# EasyEDA Pro project adapter_rfm95w_nrf242.eprj, board adapter_rfm95w_nrf24
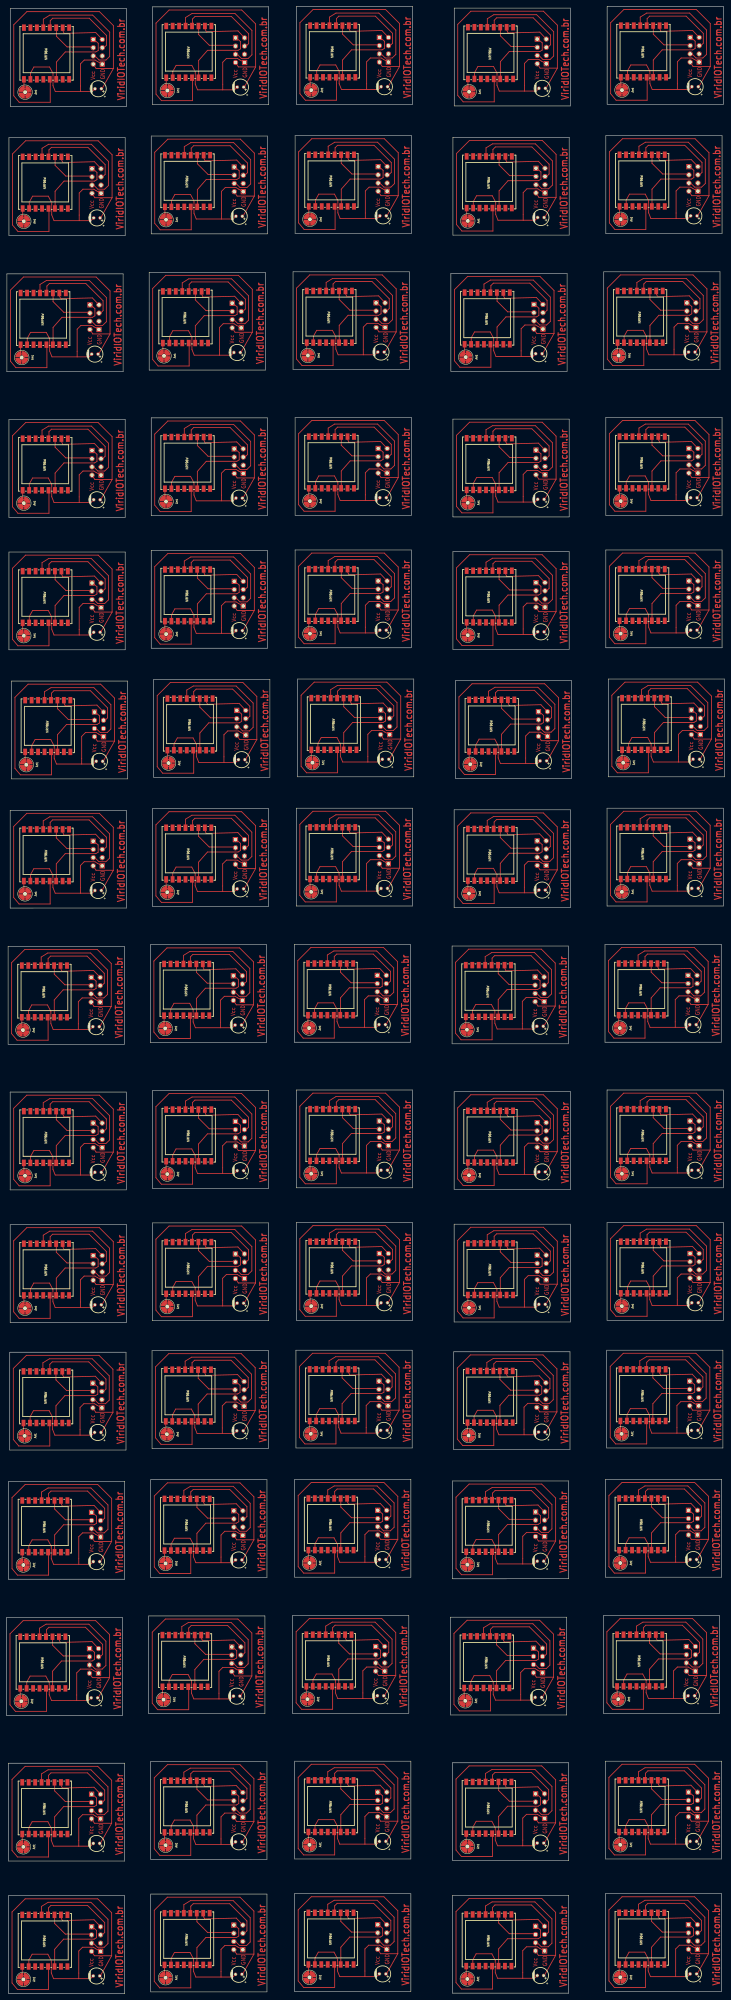
[diagram p1: board, top side]
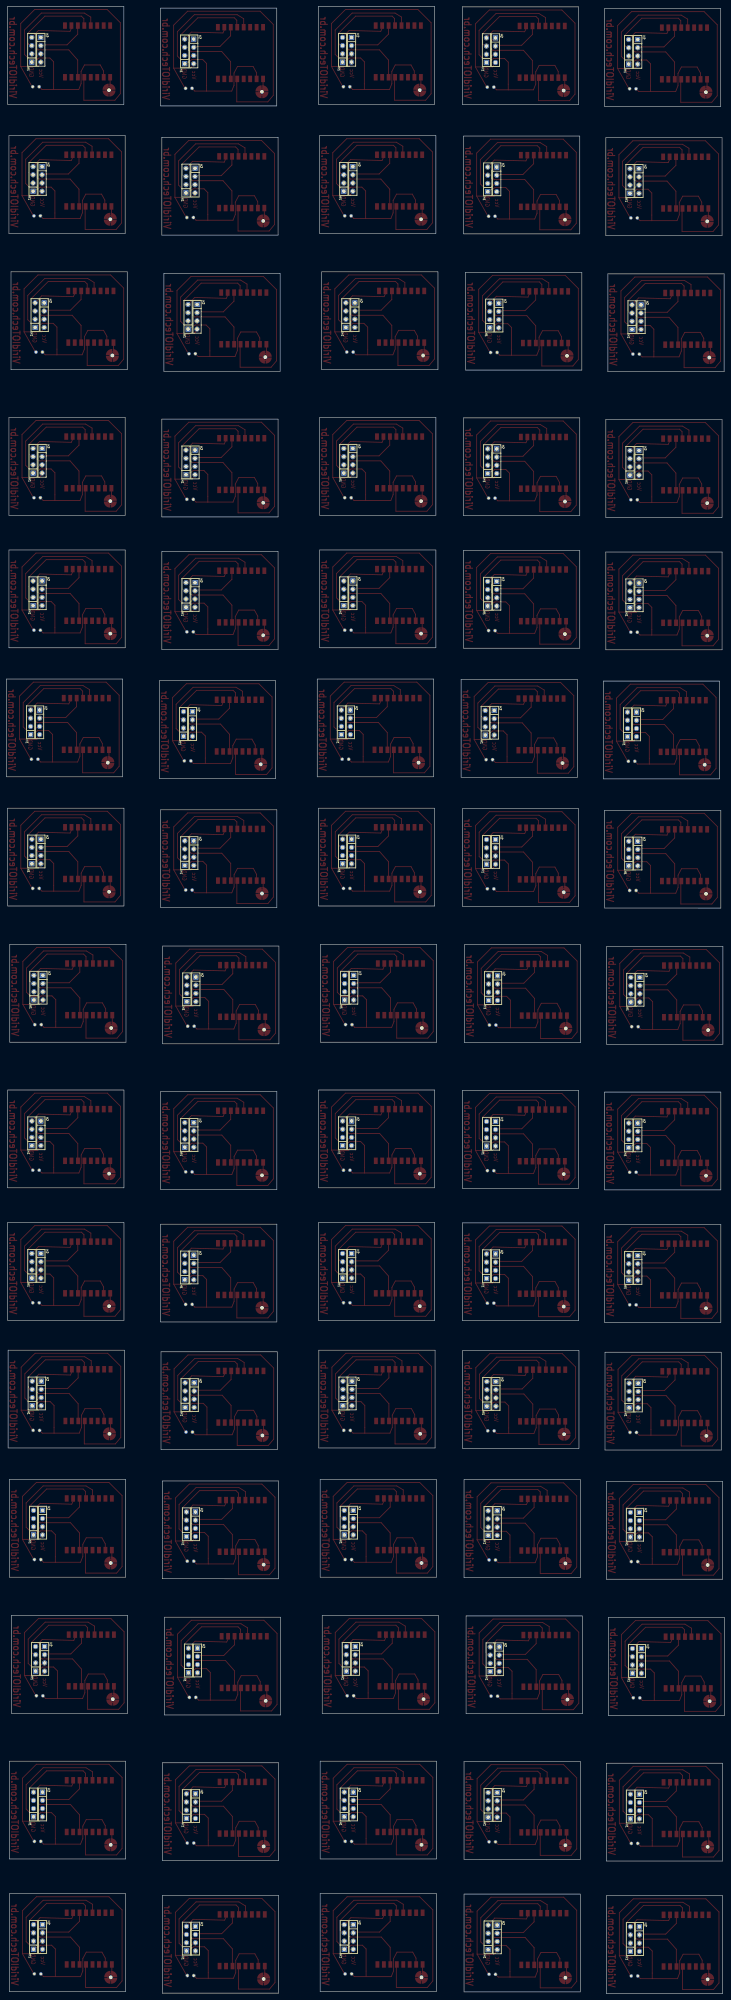
[diagram p2: board, bottom side, seen from below]

Outline 222.45 x 615.16 mm; copper layers: Top Layer, Bottom Layer. Coordinates in mm from the lower left corner of the outline.
Stack: Top Layer 0.035mm / Dielectric1 1.51mm FR4 er 4.5 / Bottom Layer 0.035mm

## Design rules (mm)
spacing safeClearance (default): track to track 0.152, other pairs 0.152 to 0.3
track width trackWidth (default): min 0.127, default 0.254, max 2.54
differential pair differentialPair (default): width min 0.127, default 0.254, max 2.54; gap min 0.152, default 0.152
via viaSize (default): diameter min 0.5, default 0.61, max 10; hole min 0.3, default 0.305, max 6

## Placement (name value [footprint] x y rotation side)
+  -  [CAP-TH_BD5.0-P2.00-D0.5-FD]  28.42 589.68 180 top
+#2  -  [CAP-TH_BD5.0-P2.00-D0.5-FD]  72.49 590.19 180 top
+#3  -  [CAP-TH_BD5.0-P2.00-D0.5-FD]  117.07 590.32 180 top
+#4  -  [CAP-TH_BD5.0-P2.00-D0.5-FD]  165.96 589.81 180 top
+#5  -  [CAP-TH_BD5.0-P2.00-D0.5-FD]  213.34 590.32 180 top
+#6  -  [CAP-TH_BD5.0-P2.00-D0.5-FD]  28.02 549.7 180 top
+#7  -  [CAP-TH_BD5.0-P2.00-D0.5-FD]  72.09 550.2 180 top
+#8  -  [CAP-TH_BD5.0-P2.00-D0.5-FD]  116.67 550.33 180 top
+#9  -  [CAP-TH_BD5.0-P2.00-D0.5-FD]  165.57 549.82 180 top
+#10  -  [CAP-TH_BD5.0-P2.00-D0.5-FD]  212.94 550.33 180 top
+#11  -  [CAP-TH_BD5.0-P2.00-D0.5-FD]  27.39 507.53 180 top
+#12  -  [CAP-TH_BD5.0-P2.00-D0.5-FD]  71.46 508.04 180 top
+#13  -  [CAP-TH_BD5.0-P2.00-D0.5-FD]  116.04 508.17 180 top
+#14  -  [CAP-TH_BD5.0-P2.00-D0.5-FD]  164.93 507.66 180 top
+#15  -  [CAP-TH_BD5.0-P2.00-D0.5-FD]  212.3 508.17 180 top
+#16  -  [CAP-TH_BD5.0-P2.00-D0.5-FD]  28.02 462.45 180 top
+#17  -  [CAP-TH_BD5.0-P2.00-D0.5-FD]  72.09 462.95 180 top
+#18  -  [CAP-TH_BD5.0-P2.00-D0.5-FD]  116.67 463.08 180 top
+#19  -  [CAP-TH_BD5.0-P2.00-D0.5-FD]  165.57 462.57 180 top
+#20  -  [CAP-TH_BD5.0-P2.00-D0.5-FD]  212.94 463.08 180 top
+#21  -  [CAP-TH_BD5.0-P2.00-D0.5-FD]  28.02 421.43 180 top
+#22  -  [CAP-TH_BD5.0-P2.00-D0.5-FD]  72.09 421.93 180 top
+#23  -  [CAP-TH_BD5.0-P2.00-D0.5-FD]  116.67 422.06 180 top
+#24  -  [CAP-TH_BD5.0-P2.00-D0.5-FD]  165.57 421.55 180 top
+#25  -  [CAP-TH_BD5.0-P2.00-D0.5-FD]  212.94 422.06 180 top
+#26  -  [CAP-TH_BD5.0-P2.00-D0.5-FD]  27.76 299.32 180 top
+#27  -  [CAP-TH_BD5.0-P2.00-D0.5-FD]  28.4 254.24 180 top
+#28  -  [CAP-TH_BD5.0-P2.00-D0.5-FD]  28.4 341.49 180 top
+#29  -  [CAP-TH_BD5.0-P2.00-D0.5-FD]  28.4 213.22 180 top
+#30  -  [CAP-TH_BD5.0-P2.00-D0.5-FD]  28.8 381.48 180 top
+#31  -  [CAP-TH_BD5.0-P2.00-D0.5-FD]  71.83 299.83 180 top
+#32  -  [CAP-TH_BD5.0-P2.00-D0.5-FD]  72.47 342 180 top
+#33  -  [CAP-TH_BD5.0-P2.00-D0.5-FD]  72.47 254.75 180 top
+#34  -  [CAP-TH_BD5.0-P2.00-D0.5-FD]  72.47 213.73 180 top
+#35  -  [CAP-TH_BD5.0-P2.00-D0.5-FD]  72.86 381.98 180 top
+#36  -  [CAP-TH_BD5.0-P2.00-D0.5-FD]  116.41 299.96 180 top
+#37  -  [CAP-TH_BD5.0-P2.00-D0.5-FD]  117.04 213.85 180 top
+#38  -  [CAP-TH_BD5.0-P2.00-D0.5-FD]  117.04 342.12 180 top
+#39  -  [CAP-TH_BD5.0-P2.00-D0.5-FD]  117.04 254.87 180 top
+#40  -  [CAP-TH_BD5.0-P2.00-D0.5-FD]  117.44 382.11 180 top
+#41  -  [CAP-TH_BD5.0-P2.00-D0.5-FD]  165.3 299.45 180 top
+#42  -  [CAP-TH_BD5.0-P2.00-D0.5-FD]  165.94 213.34 180 top
+#43  -  [CAP-TH_BD5.0-P2.00-D0.5-FD]  165.94 254.37 180 top
+#44  -  [CAP-TH_BD5.0-P2.00-D0.5-FD]  165.94 341.62 180 top
+#45  -  [CAP-TH_BD5.0-P2.00-D0.5-FD]  166.34 381.6 180 top
+#46  -  [CAP-TH_BD5.0-P2.00-D0.5-FD]  212.67 299.96 180 top
+#47  -  [CAP-TH_BD5.0-P2.00-D0.5-FD]  213.31 213.85 180 top
+#48  -  [CAP-TH_BD5.0-P2.00-D0.5-FD]  213.31 342.12 180 top
+#49  -  [CAP-TH_BD5.0-P2.00-D0.5-FD]  213.31 254.87 180 top
+#50  -  [CAP-TH_BD5.0-P2.00-D0.5-FD]  213.71 382.11 180 top
+#51  -  [CAP-TH_BD5.0-P2.00-D0.5-FD]  27.25 91.55 180 top
+#52  -  [CAP-TH_BD5.0-P2.00-D0.5-FD]  27.89 46.47 180 top
+#53  -  [CAP-TH_BD5.0-P2.00-D0.5-FD]  27.89 133.72 180 top
+#54  -  [CAP-TH_BD5.0-P2.00-D0.5-FD]  27.89 5.45 180 top
+#55  -  [CAP-TH_BD5.0-P2.00-D0.5-FD]  28.29 173.7 180 top
+#56  -  [CAP-TH_BD5.0-P2.00-D0.5-FD]  71.32 92.06 180 top
+#57  -  [CAP-TH_BD5.0-P2.00-D0.5-FD]  71.96 134.22 180 top
+#58  -  [CAP-TH_BD5.0-P2.00-D0.5-FD]  71.96 46.98 180 top
+#59  -  [CAP-TH_BD5.0-P2.00-D0.5-FD]  71.96 5.95 180 top
+#60  -  [CAP-TH_BD5.0-P2.00-D0.5-FD]  72.36 174.21 180 top
+#61  -  [CAP-TH_BD5.0-P2.00-D0.5-FD]  115.9 92.19 180 top
+#62  -  [CAP-TH_BD5.0-P2.00-D0.5-FD]  116.53 6.08 180 top
+#63  -  [CAP-TH_BD5.0-P2.00-D0.5-FD]  116.53 134.35 180 top
+#64  -  [CAP-TH_BD5.0-P2.00-D0.5-FD]  116.53 47.1 180 top
+#65  -  [CAP-TH_BD5.0-P2.00-D0.5-FD]  116.93 174.34 180 top
+#66  -  [CAP-TH_BD5.0-P2.00-D0.5-FD]  164.8 91.68 180 top
+#67  -  [CAP-TH_BD5.0-P2.00-D0.5-FD]  165.43 5.57 180 top
+#68  -  [CAP-TH_BD5.0-P2.00-D0.5-FD]  165.43 46.59 180 top
+#69  -  [CAP-TH_BD5.0-P2.00-D0.5-FD]  165.43 133.84 180 top
+#70  -  [CAP-TH_BD5.0-P2.00-D0.5-FD]  165.83 173.83 180 top
+#71  -  [CAP-TH_BD5.0-P2.00-D0.5-FD]  212.17 92.19 180 top
+#72  -  [CAP-TH_BD5.0-P2.00-D0.5-FD]  212.8 6.08 180 top
+#73  -  [CAP-TH_BD5.0-P2.00-D0.5-FD]  212.8 134.35 180 top
+#74  -  [CAP-TH_BD5.0-P2.00-D0.5-FD]  212.8 47.1 180 top
+#75  -  [CAP-TH_BD5.0-P2.00-D0.5-FD]  213.2 174.34 180 top
Ant  -  [SMD_BD4.0-L4.0-W4.0-D1.0]  5.37 548.64 0 top
Ant#2  -  [SMD_BD4.0-L4.0-W4.0-D1.0]  49.84 589.13 0 top
Ant#3  -  [SMD_BD4.0-L4.0-W4.0-D1.0]  94.42 589.26 0 top
Ant#4  -  [SMD_BD4.0-L4.0-W4.0-D1.0]  143.31 588.75 0 top
Ant#5  -  [SMD_BD4.0-L4.0-W4.0-D1.0]  190.68 589.26 0 top
Ant#6  -  [SMD_BD4.0-L4.0-W4.0-D1.0]  49.44 549.14 0 top
Ant#7  -  [SMD_BD4.0-L4.0-W4.0-D1.0]  94.02 549.27 0 top
Ant#8  -  [SMD_BD4.0-L4.0-W4.0-D1.0]  142.91 548.76 0 top
Ant#9  -  [SMD_BD4.0-L4.0-W4.0-D1.0]  190.28 549.27 0 top
Ant#10  -  [SMD_BD4.0-L4.0-W4.0-D1.0]  4.74 506.47 0 top
Ant#11  -  [SMD_BD4.0-L4.0-W4.0-D1.0]  48.81 506.98 0 top
Ant#12  -  [SMD_BD4.0-L4.0-W4.0-D1.0]  93.38 507.11 0 top
Ant#13  -  [SMD_BD4.0-L4.0-W4.0-D1.0]  142.28 506.6 0 top
Ant#14  -  [SMD_BD4.0-L4.0-W4.0-D1.0]  189.65 507.11 0 top
Ant#15  -  [SMD_BD4.0-L4.0-W4.0-D1.0]  5.37 461.39 0 top
Ant#16  -  [SMD_BD4.0-L4.0-W4.0-D1.0]  49.44 461.89 0 top
Ant#17  -  [SMD_BD4.0-L4.0-W4.0-D1.0]  94.02 462.02 0 top
Ant#18  -  [SMD_BD4.0-L4.0-W4.0-D1.0]  142.91 461.51 0 top
Ant#19  -  [SMD_BD4.0-L4.0-W4.0-D1.0]  190.28 462.02 0 top
Ant#20  -  [SMD_BD4.0-L4.0-W4.0-D1.0]  5.37 420.37 0 top
Ant#21  -  [SMD_BD4.0-L4.0-W4.0-D1.0]  49.44 420.87 0 top
Ant#22  -  [SMD_BD4.0-L4.0-W4.0-D1.0]  94.02 421 0 top
Ant#23  -  [SMD_BD4.0-L4.0-W4.0-D1.0]  142.91 420.49 0 top
Ant#24  -  [SMD_BD4.0-L4.0-W4.0-D1.0]  190.28 421 0 top
Ant#25  -  [SMD_BD4.0-L4.0-W4.0-D1.0]  5.11 298.26 0 top
Ant#26  -  [SMD_BD4.0-L4.0-W4.0-D1.0]  5.74 340.43 0 top
Ant#27  -  [SMD_BD4.0-L4.0-W4.0-D1.0]  5.74 253.18 0 top
Ant#28  -  [SMD_BD4.0-L4.0-W4.0-D1.0]  5.74 212.16 0 top
Ant#29  -  [SMD_BD4.0-L4.0-W4.0-D1.0]  6.14 380.42 0 top
Ant#30  -  [SMD_BD4.0-L4.0-W4.0-D1.0]  49.18 298.77 0 top
Ant#31  -  [SMD_BD4.0-L4.0-W4.0-D1.0]  49.81 340.94 0 top
Ant#32  -  [SMD_BD4.0-L4.0-W4.0-D1.0]  49.81 212.67 0 top
Ant#33  -  [SMD_BD4.0-L4.0-W4.0-D1.0]  49.81 253.69 0 top
Ant#34  -  [SMD_BD4.0-L4.0-W4.0-D1.0]  50.21 380.92 0 top
Ant#35  -  [SMD_BD4.0-L4.0-W4.0-D1.0]  93.75 298.9 0 top
Ant#36  -  [SMD_BD4.0-L4.0-W4.0-D1.0]  94.39 253.81 0 top
Ant#37  -  [SMD_BD4.0-L4.0-W4.0-D1.0]  94.39 341.06 0 top
Ant#38  -  [SMD_BD4.0-L4.0-W4.0-D1.0]  94.39 212.79 0 top
Ant#39  -  [SMD_BD4.0-L4.0-W4.0-D1.0]  94.79 381.05 0 top
Ant#40  -  [SMD_BD4.0-L4.0-W4.0-D1.0]  142.65 298.39 0 top
Ant#41  -  [SMD_BD4.0-L4.0-W4.0-D1.0]  143.28 253.31 0 top
Ant#42  -  [SMD_BD4.0-L4.0-W4.0-D1.0]  143.28 340.56 0 top
Ant#43  -  [SMD_BD4.0-L4.0-W4.0-D1.0]  143.28 212.29 0 top
Ant#44  -  [SMD_BD4.0-L4.0-W4.0-D1.0]  143.68 380.54 0 top
Ant#45  -  [SMD_BD4.0-L4.0-W4.0-D1.0]  190.02 298.9 0 top
Ant#46  -  [SMD_BD4.0-L4.0-W4.0-D1.0]  190.66 212.79 0 top
Ant#47  -  [SMD_BD4.0-L4.0-W4.0-D1.0]  190.66 253.81 0 top
Ant#48  -  [SMD_BD4.0-L4.0-W4.0-D1.0]  190.66 341.06 0 top
Ant#49  -  [SMD_BD4.0-L4.0-W4.0-D1.0]  191.05 381.05 0 top
Ant#50  -  [SMD_BD4.0-L4.0-W4.0-D1.0]  4.6 90.49 0 top
Ant#51  -  [SMD_BD4.0-L4.0-W4.0-D1.0]  5.24 132.66 0 top
Ant#52  -  [SMD_BD4.0-L4.0-W4.0-D1.0]  5.24 45.41 0 top
Ant#53  -  [SMD_BD4.0-L4.0-W4.0-D1.0]  5.24 4.39 0 top
Ant#54  -  [SMD_BD4.0-L4.0-W4.0-D1.0]  5.63 172.64 0 top
Ant#55  -  [SMD_BD4.0-L4.0-W4.0-D1.0]  48.67 91 0 top
Ant#56  -  [SMD_BD4.0-L4.0-W4.0-D1.0]  49.3 133.16 0 top
Ant#57  -  [SMD_BD4.0-L4.0-W4.0-D1.0]  49.3 4.89 0 top
Ant#58  -  [SMD_BD4.0-L4.0-W4.0-D1.0]  49.3 45.92 0 top
Ant#59  -  [SMD_BD4.0-L4.0-W4.0-D1.0]  49.7 173.15 0 top
Ant#60  -  [SMD_BD4.0-L4.0-W4.0-D1.0]  93.25 91.13 0 top
Ant#61  -  [SMD_BD4.0-L4.0-W4.0-D1.0]  93.88 46.04 0 top
Ant#62  -  [SMD_BD4.0-L4.0-W4.0-D1.0]  93.88 133.29 0 top
Ant#63  -  [SMD_BD4.0-L4.0-W4.0-D1.0]  93.88 5.02 0 top
Ant#64  -  [SMD_BD4.0-L4.0-W4.0-D1.0]  94.28 173.28 0 top
Ant#65  -  [SMD_BD4.0-L4.0-W4.0-D1.0]  142.14 90.62 0 top
Ant#66  -  [SMD_BD4.0-L4.0-W4.0-D1.0]  142.78 45.53 0 top
Ant#67  -  [SMD_BD4.0-L4.0-W4.0-D1.0]  142.78 132.78 0 top
Ant#68  -  [SMD_BD4.0-L4.0-W4.0-D1.0]  142.78 4.51 0 top
Ant#69  -  [SMD_BD4.0-L4.0-W4.0-D1.0]  143.18 172.77 0 top
Ant#70  -  [SMD_BD4.0-L4.0-W4.0-D1.0]  189.51 91.13 0 top
Ant#71  -  [SMD_BD4.0-L4.0-W4.0-D1.0]  190.15 5.02 0 top
Ant#72  -  [SMD_BD4.0-L4.0-W4.0-D1.0]  190.15 46.04 0 top
Ant#73  -  [SMD_BD4.0-L4.0-W4.0-D1.0]  190.15 133.29 0 top
Ant#74  -  [SMD_BD4.0-L4.0-W4.0-D1.0]  190.55 173.28 0 top
Ant#75  -  [SMD_BD4.0-L4.0-W4.0-D1.0]  5.77 588.62 0 top
H1  HX PH254-01-04-Z-L11.5 straight pin header  [HDR-TH_4P-HX-PH254-01-04-Z-L11.5]  73.76 601.62 90 bottom
H1#2  -  [HDR-TH_4P-HX-PH254-01-04-Z-L11.5]  118.34 601.75 90 bottom
H1#3  -  [HDR-TH_4P-HX-PH254-01-04-Z-L11.5]  167.23 601.24 90 bottom
H1#4  -  [HDR-TH_4P-HX-PH254-01-04-Z-L11.5]  214.61 601.75 90 bottom
H1#5  -  [HDR-TH_4P-HX-PH254-01-04-Z-L11.5]  29.69 601.11 90 bottom
H1#6  -  [HDR-TH_4P-HX-PH254-01-04-Z-L11.5]  29.29 561.13 90 bottom
H1#7  -  [HDR-TH_4P-HX-PH254-01-04-Z-L11.5]  73.36 561.63 90 bottom
H1#8  -  [HDR-TH_4P-HX-PH254-01-04-Z-L11.5]  117.94 561.76 90 bottom
H1#9  -  [HDR-TH_4P-HX-PH254-01-04-Z-L11.5]  166.84 561.25 90 bottom
H1#10  -  [HDR-TH_4P-HX-PH254-01-04-Z-L11.5]  214.21 561.76 90 bottom
H1#11  -  [HDR-TH_4P-HX-PH254-01-04-Z-L11.5]  28.66 518.96 90 bottom
H1#12  -  [HDR-TH_4P-HX-PH254-01-04-Z-L11.5]  72.73 519.47 90 bottom
H1#13  -  [HDR-TH_4P-HX-PH254-01-04-Z-L11.5]  117.31 519.6 90 bottom
H1#14  -  [HDR-TH_4P-HX-PH254-01-04-Z-L11.5]  166.2 519.09 90 bottom
H1#15  -  [HDR-TH_4P-HX-PH254-01-04-Z-L11.5]  213.57 519.6 90 bottom
H1#16  -  [HDR-TH_4P-HX-PH254-01-04-Z-L11.5]  29.29 473.88 90 bottom
H1#17  -  [HDR-TH_4P-HX-PH254-01-04-Z-L11.5]  73.36 474.38 90 bottom
H1#18  -  [HDR-TH_4P-HX-PH254-01-04-Z-L11.5]  117.94 474.51 90 bottom
H1#19  -  [HDR-TH_4P-HX-PH254-01-04-Z-L11.5]  166.84 474 90 bottom
H1#20  -  [HDR-TH_4P-HX-PH254-01-04-Z-L11.5]  214.21 474.51 90 bottom
H1#21  -  [HDR-TH_4P-HX-PH254-01-04-Z-L11.5]  29.29 432.86 90 bottom
H1#22  -  [HDR-TH_4P-HX-PH254-01-04-Z-L11.5]  73.36 433.36 90 bottom
H1#23  -  [HDR-TH_4P-HX-PH254-01-04-Z-L11.5]  117.94 433.49 90 bottom
H1#24  -  [HDR-TH_4P-HX-PH254-01-04-Z-L11.5]  166.84 432.98 90 bottom
H1#25  -  [HDR-TH_4P-HX-PH254-01-04-Z-L11.5]  214.21 433.49 90 bottom
H1#26  -  [HDR-TH_4P-HX-PH254-01-04-Z-L11.5]  29.03 310.75 90 bottom
H1#27  -  [HDR-TH_4P-HX-PH254-01-04-Z-L11.5]  29.67 352.92 90 bottom
H1#28  -  [HDR-TH_4P-HX-PH254-01-04-Z-L11.5]  29.67 265.67 90 bottom
H1#29  -  [HDR-TH_4P-HX-PH254-01-04-Z-L11.5]  29.67 224.65 90 bottom
H1#30  -  [HDR-TH_4P-HX-PH254-01-04-Z-L11.5]  30.07 392.91 90 bottom
H1#31  -  [HDR-TH_4P-HX-PH254-01-04-Z-L11.5]  73.1 311.26 90 bottom
H1#32  -  [HDR-TH_4P-HX-PH254-01-04-Z-L11.5]  73.74 353.43 90 bottom
H1#33  -  [HDR-TH_4P-HX-PH254-01-04-Z-L11.5]  73.74 266.18 90 bottom
H1#34  -  [HDR-TH_4P-HX-PH254-01-04-Z-L11.5]  73.74 225.16 90 bottom
H1#35  -  [HDR-TH_4P-HX-PH254-01-04-Z-L11.5]  74.13 393.41 90 bottom
H1#36  -  [HDR-TH_4P-HX-PH254-01-04-Z-L11.5]  117.68 311.39 90 bottom
H1#37  -  [HDR-TH_4P-HX-PH254-01-04-Z-L11.5]  118.31 266.3 90 bottom
H1#38  -  [HDR-TH_4P-HX-PH254-01-04-Z-L11.5]  118.31 353.55 90 bottom
H1#39  -  [HDR-TH_4P-HX-PH254-01-04-Z-L11.5]  118.31 225.28 90 bottom
H1#40  -  [HDR-TH_4P-HX-PH254-01-04-Z-L11.5]  118.71 393.54 90 bottom
H1#41  -  [HDR-TH_4P-HX-PH254-01-04-Z-L11.5]  166.57 310.88 90 bottom
H1#42  -  [HDR-TH_4P-HX-PH254-01-04-Z-L11.5]  167.21 353.05 90 bottom
H1#43  -  [HDR-TH_4P-HX-PH254-01-04-Z-L11.5]  167.21 265.8 90 bottom
H1#44  -  [HDR-TH_4P-HX-PH254-01-04-Z-L11.5]  167.21 224.78 90 bottom
H1#45  -  [HDR-TH_4P-HX-PH254-01-04-Z-L11.5]  167.61 393.03 90 bottom
H1#46  -  [HDR-TH_4P-HX-PH254-01-04-Z-L11.5]  213.94 311.39 90 bottom
H1#47  -  [HDR-TH_4P-HX-PH254-01-04-Z-L11.5]  214.58 225.28 90 bottom
H1#48  -  [HDR-TH_4P-HX-PH254-01-04-Z-L11.5]  214.58 353.55 90 bottom
H1#49  -  [HDR-TH_4P-HX-PH254-01-04-Z-L11.5]  214.58 266.3 90 bottom
H1#50  -  [HDR-TH_4P-HX-PH254-01-04-Z-L11.5]  214.98 393.54 90 bottom
H1#51  -  [HDR-TH_4P-HX-PH254-01-04-Z-L11.5]  28.52 102.98 90 bottom
H1#52  -  [HDR-TH_4P-HX-PH254-01-04-Z-L11.5]  29.16 145.15 90 bottom
H1#53  -  [HDR-TH_4P-HX-PH254-01-04-Z-L11.5]  29.16 57.9 90 bottom
H1#54  -  [HDR-TH_4P-HX-PH254-01-04-Z-L11.5]  29.16 16.88 90 bottom
H1#55  -  [HDR-TH_4P-HX-PH254-01-04-Z-L11.5]  29.56 185.13 90 bottom
H1#56  -  [HDR-TH_4P-HX-PH254-01-04-Z-L11.5]  72.59 103.49 90 bottom
H1#57  -  [HDR-TH_4P-HX-PH254-01-04-Z-L11.5]  73.23 145.65 90 bottom
H1#58  -  [HDR-TH_4P-HX-PH254-01-04-Z-L11.5]  73.23 58.41 90 bottom
H1#59  -  [HDR-TH_4P-HX-PH254-01-04-Z-L11.5]  73.23 17.38 90 bottom
H1#60  -  [HDR-TH_4P-HX-PH254-01-04-Z-L11.5]  73.63 185.64 90 bottom
H1#61  -  [HDR-TH_4P-HX-PH254-01-04-Z-L11.5]  117.17 103.62 90 bottom
H1#62  -  [HDR-TH_4P-HX-PH254-01-04-Z-L11.5]  117.81 58.53 90 bottom
H1#63  -  [HDR-TH_4P-HX-PH254-01-04-Z-L11.5]  117.81 145.78 90 bottom
H1#64  -  [HDR-TH_4P-HX-PH254-01-04-Z-L11.5]  117.81 17.51 90 bottom
H1#65  -  [HDR-TH_4P-HX-PH254-01-04-Z-L11.5]  118.2 185.77 90 bottom
H1#66  -  [HDR-TH_4P-HX-PH254-01-04-Z-L11.5]  166.06 103.11 90 bottom
H1#67  -  [HDR-TH_4P-HX-PH254-01-04-Z-L11.5]  166.7 145.27 90 bottom
H1#68  -  [HDR-TH_4P-HX-PH254-01-04-Z-L11.5]  166.7 58.02 90 bottom
H1#69  -  [HDR-TH_4P-HX-PH254-01-04-Z-L11.5]  166.7 17 90 bottom
H1#70  -  [HDR-TH_4P-HX-PH254-01-04-Z-L11.5]  167.1 185.26 90 bottom
H1#71  -  [HDR-TH_4P-HX-PH254-01-04-Z-L11.5]  213.44 103.62 90 bottom
H1#72  -  [HDR-TH_4P-HX-PH254-01-04-Z-L11.5]  214.07 17.51 90 bottom
H1#73  -  [HDR-TH_4P-HX-PH254-01-04-Z-L11.5]  214.07 145.78 90 bottom
H1#74  -  [HDR-TH_4P-HX-PH254-01-04-Z-L11.5]  214.07 58.53 90 bottom
H1#75  -  [HDR-TH_4P-HX-PH254-01-04-Z-L11.5]  214.47 185.77 90 bottom
H2  HX PH254-01-04-Z-L11.5 straight pin header  [HDR-TH_4P-HX-PH254-01-04-Z-L11.5]  70.97 601.62 270 bottom
H2#2  -  [HDR-TH_4P-HX-PH254-01-04-Z-L11.5]  115.55 601.75 270 bottom
H2#3  -  [HDR-TH_4P-HX-PH254-01-04-Z-L11.5]  164.44 601.24 270 bottom
H2#4  -  [HDR-TH_4P-HX-PH254-01-04-Z-L11.5]  211.81 601.75 270 bottom
H2#5  -  [HDR-TH_4P-HX-PH254-01-04-Z-L11.5]  26.9 601.11 270 bottom
H2#6  -  [HDR-TH_4P-HX-PH254-01-04-Z-L11.5]  26.5 561.13 270 bottom
H2#7  -  [HDR-TH_4P-HX-PH254-01-04-Z-L11.5]  70.57 561.63 270 bottom
H2#8  -  [HDR-TH_4P-HX-PH254-01-04-Z-L11.5]  115.15 561.76 270 bottom
H2#9  -  [HDR-TH_4P-HX-PH254-01-04-Z-L11.5]  164.04 561.25 270 bottom
H2#10  -  [HDR-TH_4P-HX-PH254-01-04-Z-L11.5]  211.41 561.76 270 bottom
H2#11  -  [HDR-TH_4P-HX-PH254-01-04-Z-L11.5]  25.87 518.96 270 bottom
H2#12  -  [HDR-TH_4P-HX-PH254-01-04-Z-L11.5]  69.94 519.47 270 bottom
H2#13  -  [HDR-TH_4P-HX-PH254-01-04-Z-L11.5]  114.51 519.6 270 bottom
H2#14  -  [HDR-TH_4P-HX-PH254-01-04-Z-L11.5]  163.41 519.09 270 bottom
H2#15  -  [HDR-TH_4P-HX-PH254-01-04-Z-L11.5]  210.78 519.6 270 bottom
H2#16  -  [HDR-TH_4P-HX-PH254-01-04-Z-L11.5]  26.5 473.88 270 bottom
H2#17  -  [HDR-TH_4P-HX-PH254-01-04-Z-L11.5]  70.57 474.38 270 bottom
H2#18  -  [HDR-TH_4P-HX-PH254-01-04-Z-L11.5]  115.15 474.51 270 bottom
H2#19  -  [HDR-TH_4P-HX-PH254-01-04-Z-L11.5]  164.04 474 270 bottom
H2#20  -  [HDR-TH_4P-HX-PH254-01-04-Z-L11.5]  211.41 474.51 270 bottom
H2#21  -  [HDR-TH_4P-HX-PH254-01-04-Z-L11.5]  26.5 432.86 270 bottom
H2#22  -  [HDR-TH_4P-HX-PH254-01-04-Z-L11.5]  70.57 433.36 270 bottom
H2#23  -  [HDR-TH_4P-HX-PH254-01-04-Z-L11.5]  115.15 433.49 270 bottom
H2#24  -  [HDR-TH_4P-HX-PH254-01-04-Z-L11.5]  164.04 432.98 270 bottom
H2#25  -  [HDR-TH_4P-HX-PH254-01-04-Z-L11.5]  211.41 433.49 270 bottom
H2#26  -  [HDR-TH_4P-HX-PH254-01-04-Z-L11.5]  26.24 310.75 270 bottom
H2#27  -  [HDR-TH_4P-HX-PH254-01-04-Z-L11.5]  26.87 224.65 270 bottom
H2#28  -  [HDR-TH_4P-HX-PH254-01-04-Z-L11.5]  26.87 352.92 270 bottom
H2#29  -  [HDR-TH_4P-HX-PH254-01-04-Z-L11.5]  26.87 265.67 270 bottom
H2#30  -  [HDR-TH_4P-HX-PH254-01-04-Z-L11.5]  27.27 392.91 270 bottom
H2#31  -  [HDR-TH_4P-HX-PH254-01-04-Z-L11.5]  70.31 311.26 270 bottom
H2#32  -  [HDR-TH_4P-HX-PH254-01-04-Z-L11.5]  70.94 225.16 270 bottom
H2#33  -  [HDR-TH_4P-HX-PH254-01-04-Z-L11.5]  70.94 353.43 270 bottom
H2#34  -  [HDR-TH_4P-HX-PH254-01-04-Z-L11.5]  70.94 266.18 270 bottom
H2#35  -  [HDR-TH_4P-HX-PH254-01-04-Z-L11.5]  71.34 393.41 270 bottom
H2#36  -  [HDR-TH_4P-HX-PH254-01-04-Z-L11.5]  114.88 311.39 270 bottom
H2#37  -  [HDR-TH_4P-HX-PH254-01-04-Z-L11.5]  115.52 353.55 270 bottom
H2#38  -  [HDR-TH_4P-HX-PH254-01-04-Z-L11.5]  115.52 266.3 270 bottom
H2#39  -  [HDR-TH_4P-HX-PH254-01-04-Z-L11.5]  115.52 225.28 270 bottom
H2#40  -  [HDR-TH_4P-HX-PH254-01-04-Z-L11.5]  115.92 393.54 270 bottom
H2#41  -  [HDR-TH_4P-HX-PH254-01-04-Z-L11.5]  163.78 310.88 270 bottom
H2#42  -  [HDR-TH_4P-HX-PH254-01-04-Z-L11.5]  164.41 224.78 270 bottom
H2#43  -  [HDR-TH_4P-HX-PH254-01-04-Z-L11.5]  164.41 265.8 270 bottom
H2#44  -  [HDR-TH_4P-HX-PH254-01-04-Z-L11.5]  164.41 353.05 270 bottom
H2#45  -  [HDR-TH_4P-HX-PH254-01-04-Z-L11.5]  164.81 393.03 270 bottom
H2#46  -  [HDR-TH_4P-HX-PH254-01-04-Z-L11.5]  211.15 311.39 270 bottom
H2#47  -  [HDR-TH_4P-HX-PH254-01-04-Z-L11.5]  211.78 225.28 270 bottom
H2#48  -  [HDR-TH_4P-HX-PH254-01-04-Z-L11.5]  211.78 353.55 270 bottom
H2#49  -  [HDR-TH_4P-HX-PH254-01-04-Z-L11.5]  211.78 266.3 270 bottom
H2#50  -  [HDR-TH_4P-HX-PH254-01-04-Z-L11.5]  212.18 393.54 270 bottom
H2#51  -  [HDR-TH_4P-HX-PH254-01-04-Z-L11.5]  25.73 102.98 270 bottom
H2#52  -  [HDR-TH_4P-HX-PH254-01-04-Z-L11.5]  26.37 16.88 270 bottom
H2#53  -  [HDR-TH_4P-HX-PH254-01-04-Z-L11.5]  26.37 145.15 270 bottom
H2#54  -  [HDR-TH_4P-HX-PH254-01-04-Z-L11.5]  26.37 57.9 270 bottom
H2#55  -  [HDR-TH_4P-HX-PH254-01-04-Z-L11.5]  26.76 185.13 270 bottom
H2#56  -  [HDR-TH_4P-HX-PH254-01-04-Z-L11.5]  69.8 103.49 270 bottom
H2#57  -  [HDR-TH_4P-HX-PH254-01-04-Z-L11.5]  70.43 17.38 270 bottom
H2#58  -  [HDR-TH_4P-HX-PH254-01-04-Z-L11.5]  70.43 145.65 270 bottom
H2#59  -  [HDR-TH_4P-HX-PH254-01-04-Z-L11.5]  70.43 58.41 270 bottom
H2#60  -  [HDR-TH_4P-HX-PH254-01-04-Z-L11.5]  70.83 185.64 270 bottom
H2#61  -  [HDR-TH_4P-HX-PH254-01-04-Z-L11.5]  114.38 103.62 270 bottom
H2#62  -  [HDR-TH_4P-HX-PH254-01-04-Z-L11.5]  115.01 145.78 270 bottom
H2#63  -  [HDR-TH_4P-HX-PH254-01-04-Z-L11.5]  115.01 58.53 270 bottom
H2#64  -  [HDR-TH_4P-HX-PH254-01-04-Z-L11.5]  115.01 17.51 270 bottom
H2#65  -  [HDR-TH_4P-HX-PH254-01-04-Z-L11.5]  115.41 185.77 270 bottom
H2#66  -  [HDR-TH_4P-HX-PH254-01-04-Z-L11.5]  163.27 103.11 270 bottom
H2#67  -  [HDR-TH_4P-HX-PH254-01-04-Z-L11.5]  163.91 17 270 bottom
H2#68  -  [HDR-TH_4P-HX-PH254-01-04-Z-L11.5]  163.91 58.02 270 bottom
H2#69  -  [HDR-TH_4P-HX-PH254-01-04-Z-L11.5]  163.91 145.27 270 bottom
H2#70  -  [HDR-TH_4P-HX-PH254-01-04-Z-L11.5]  164.3 185.26 270 bottom
H2#71  -  [HDR-TH_4P-HX-PH254-01-04-Z-L11.5]  210.64 103.62 270 bottom
H2#72  -  [HDR-TH_4P-HX-PH254-01-04-Z-L11.5]  211.28 17.51 270 bottom
H2#73  -  [HDR-TH_4P-HX-PH254-01-04-Z-L11.5]  211.28 145.78 270 bottom
H2#74  -  [HDR-TH_4P-HX-PH254-01-04-Z-L11.5]  211.28 58.53 270 bottom
H2#75  -  [HDR-TH_4P-HX-PH254-01-04-Z-L11.5]  211.68 185.77 270 bottom
NRF96W  -  [WIRELM-SMD_16P-L16.0-W16.0-P2.00_LORA-CC68-915MHZ-TCXO]  56.49 601.11 270 top
NRF96W#2  -  [WIRELM-SMD_16P-L16.0-W16.0-P2.00_LORA-CC68-915MHZ-TCXO]  101.07 601.24 270 top
NRF96W#3  -  [WIRELM-SMD_16P-L16.0-W16.0-P2.00_LORA-CC68-915MHZ-TCXO]  149.96 600.73 270 top
NRF96W#4  -  [WIRELM-SMD_16P-L16.0-W16.0-P2.00_LORA-CC68-915MHZ-TCXO]  197.33 601.24 270 top
NRF96W#5  -  [WIRELM-SMD_16P-L16.0-W16.0-P2.00_LORA-CC68-915MHZ-TCXO]  12.42 600.6 270 top
NRF96W#6  -  [WIRELM-SMD_16P-L16.0-W16.0-P2.00_LORA-CC68-915MHZ-TCXO]  12.02 560.62 270 top
NRF96W#7  -  [WIRELM-SMD_16P-L16.0-W16.0-P2.00_LORA-CC68-915MHZ-TCXO]  56.09 561.13 270 top
NRF96W#8  -  [WIRELM-SMD_16P-L16.0-W16.0-P2.00_LORA-CC68-915MHZ-TCXO]  100.67 561.25 270 top
NRF96W#9  -  [WIRELM-SMD_16P-L16.0-W16.0-P2.00_LORA-CC68-915MHZ-TCXO]  149.56 560.74 270 top
NRF96W#10  -  [WIRELM-SMD_16P-L16.0-W16.0-P2.00_LORA-CC68-915MHZ-TCXO]  196.94 561.25 270 top
NRF96W#11  -  [WIRELM-SMD_16P-L16.0-W16.0-P2.00_LORA-CC68-915MHZ-TCXO]  11.39 518.45 270 top
NRF96W#12  -  [WIRELM-SMD_16P-L16.0-W16.0-P2.00_LORA-CC68-915MHZ-TCXO]  55.46 518.96 270 top
NRF96W#13  -  [WIRELM-SMD_16P-L16.0-W16.0-P2.00_LORA-CC68-915MHZ-TCXO]  100.03 519.09 270 top
NRF96W#14  -  [WIRELM-SMD_16P-L16.0-W16.0-P2.00_LORA-CC68-915MHZ-TCXO]  148.93 518.58 270 top
NRF96W#15  -  [WIRELM-SMD_16P-L16.0-W16.0-P2.00_LORA-CC68-915MHZ-TCXO]  196.3 519.09 270 top
NRF96W#16  -  [WIRELM-SMD_16P-L16.0-W16.0-P2.00_LORA-CC68-915MHZ-TCXO]  12.02 473.37 270 top
NRF96W#17  -  [WIRELM-SMD_16P-L16.0-W16.0-P2.00_LORA-CC68-915MHZ-TCXO]  56.09 473.88 270 top
NRF96W#18  -  [WIRELM-SMD_16P-L16.0-W16.0-P2.00_LORA-CC68-915MHZ-TCXO]  100.67 474 270 top
NRF96W#19  -  [WIRELM-SMD_16P-L16.0-W16.0-P2.00_LORA-CC68-915MHZ-TCXO]  149.56 473.5 270 top
NRF96W#20  -  [WIRELM-SMD_16P-L16.0-W16.0-P2.00_LORA-CC68-915MHZ-TCXO]  196.94 474 270 top
NRF96W#21  -  [WIRELM-SMD_16P-L16.0-W16.0-P2.00_LORA-CC68-915MHZ-TCXO]  12.02 432.35 270 top
NRF96W#22  -  [WIRELM-SMD_16P-L16.0-W16.0-P2.00_LORA-CC68-915MHZ-TCXO]  56.09 432.86 270 top
NRF96W#23  -  [WIRELM-SMD_16P-L16.0-W16.0-P2.00_LORA-CC68-915MHZ-TCXO]  100.67 432.98 270 top
NRF96W#24  -  [WIRELM-SMD_16P-L16.0-W16.0-P2.00_LORA-CC68-915MHZ-TCXO]  149.56 432.47 270 top
NRF96W#25  -  [WIRELM-SMD_16P-L16.0-W16.0-P2.00_LORA-CC68-915MHZ-TCXO]  196.94 432.98 270 top
NRF96W#26  -  [WIRELM-SMD_16P-L16.0-W16.0-P2.00_LORA-CC68-915MHZ-TCXO]  12.29 184.62 270 top
NRF96W#27  -  [WIRELM-SMD_16P-L16.0-W16.0-P2.00_LORA-CC68-915MHZ-TCXO]  11.76 310.25 270 top
NRF96W#28  -  [WIRELM-SMD_16P-L16.0-W16.0-P2.00_LORA-CC68-915MHZ-TCXO]  12.4 352.41 270 top
NRF96W#29  -  [WIRELM-SMD_16P-L16.0-W16.0-P2.00_LORA-CC68-915MHZ-TCXO]  12.4 265.16 270 top
NRF96W#30  -  [WIRELM-SMD_16P-L16.0-W16.0-P2.00_LORA-CC68-915MHZ-TCXO]  12.4 224.14 270 top
NRF96W#31  -  [WIRELM-SMD_16P-L16.0-W16.0-P2.00_LORA-CC68-915MHZ-TCXO]  12.79 392.4 270 top
NRF96W#32  -  [WIRELM-SMD_16P-L16.0-W16.0-P2.00_LORA-CC68-915MHZ-TCXO]  55.83 310.75 270 top
NRF96W#33  -  [WIRELM-SMD_16P-L16.0-W16.0-P2.00_LORA-CC68-915MHZ-TCXO]  56.46 265.67 270 top
NRF96W#34  -  [WIRELM-SMD_16P-L16.0-W16.0-P2.00_LORA-CC68-915MHZ-TCXO]  56.46 352.92 270 top
NRF96W#35  -  [WIRELM-SMD_16P-L16.0-W16.0-P2.00_LORA-CC68-915MHZ-TCXO]  56.46 224.65 270 top
NRF96W#36  -  [WIRELM-SMD_16P-L16.0-W16.0-P2.00_LORA-CC68-915MHZ-TCXO]  56.86 392.91 270 top
NRF96W#37  -  [WIRELM-SMD_16P-L16.0-W16.0-P2.00_LORA-CC68-915MHZ-TCXO]  100.41 310.88 270 top
NRF96W#38  -  [WIRELM-SMD_16P-L16.0-W16.0-P2.00_LORA-CC68-915MHZ-TCXO]  101.04 224.78 270 top
NRF96W#39  -  [WIRELM-SMD_16P-L16.0-W16.0-P2.00_LORA-CC68-915MHZ-TCXO]  101.04 353.05 270 top
NRF96W#40  -  [WIRELM-SMD_16P-L16.0-W16.0-P2.00_LORA-CC68-915MHZ-TCXO]  101.04 265.8 270 top
NRF96W#41  -  [WIRELM-SMD_16P-L16.0-W16.0-P2.00_LORA-CC68-915MHZ-TCXO]  101.44 393.03 270 top
NRF96W#42  -  [WIRELM-SMD_16P-L16.0-W16.0-P2.00_LORA-CC68-915MHZ-TCXO]  149.3 310.37 270 top
NRF96W#43  -  [WIRELM-SMD_16P-L16.0-W16.0-P2.00_LORA-CC68-915MHZ-TCXO]  149.94 224.27 270 top
NRF96W#44  -  [WIRELM-SMD_16P-L16.0-W16.0-P2.00_LORA-CC68-915MHZ-TCXO]  149.94 352.54 270 top
NRF96W#45  -  [WIRELM-SMD_16P-L16.0-W16.0-P2.00_LORA-CC68-915MHZ-TCXO]  149.94 265.29 270 top
NRF96W#46  -  [WIRELM-SMD_16P-L16.0-W16.0-P2.00_LORA-CC68-915MHZ-TCXO]  150.33 392.52 270 top
NRF96W#47  -  [WIRELM-SMD_16P-L16.0-W16.0-P2.00_LORA-CC68-915MHZ-TCXO]  196.67 310.88 270 top
NRF96W#48  -  [WIRELM-SMD_16P-L16.0-W16.0-P2.00_LORA-CC68-915MHZ-TCXO]  197.31 265.8 270 top
NRF96W#49  -  [WIRELM-SMD_16P-L16.0-W16.0-P2.00_LORA-CC68-915MHZ-TCXO]  197.31 224.78 270 top
NRF96W#50  -  [WIRELM-SMD_16P-L16.0-W16.0-P2.00_LORA-CC68-915MHZ-TCXO]  197.31 353.05 270 top
NRF96W#51  -  [WIRELM-SMD_16P-L16.0-W16.0-P2.00_LORA-CC68-915MHZ-TCXO]  197.71 393.03 270 top
NRF96W#52  -  [WIRELM-SMD_16P-L16.0-W16.0-P2.00_LORA-CC68-915MHZ-TCXO]  11.25 102.47 270 top
NRF96W#53  -  [WIRELM-SMD_16P-L16.0-W16.0-P2.00_LORA-CC68-915MHZ-TCXO]  11.89 144.64 270 top
NRF96W#54  -  [WIRELM-SMD_16P-L16.0-W16.0-P2.00_LORA-CC68-915MHZ-TCXO]  11.89 57.39 270 top
NRF96W#55  -  [WIRELM-SMD_16P-L16.0-W16.0-P2.00_LORA-CC68-915MHZ-TCXO]  11.89 16.37 270 top
NRF96W#56  -  [WIRELM-SMD_16P-L16.0-W16.0-P2.00_LORA-CC68-915MHZ-TCXO]  55.32 102.98 270 top
NRF96W#57  -  [WIRELM-SMD_16P-L16.0-W16.0-P2.00_LORA-CC68-915MHZ-TCXO]  55.96 57.9 270 top
NRF96W#58  -  [WIRELM-SMD_16P-L16.0-W16.0-P2.00_LORA-CC68-915MHZ-TCXO]  55.96 145.15 270 top
NRF96W#59  -  [WIRELM-SMD_16P-L16.0-W16.0-P2.00_LORA-CC68-915MHZ-TCXO]  55.96 16.88 270 top
NRF96W#60  -  [WIRELM-SMD_16P-L16.0-W16.0-P2.00_LORA-CC68-915MHZ-TCXO]  56.35 185.13 270 top
NRF96W#61  -  [WIRELM-SMD_16P-L16.0-W16.0-P2.00_LORA-CC68-915MHZ-TCXO]  99.9 103.11 270 top
NRF96W#62  -  [WIRELM-SMD_16P-L16.0-W16.0-P2.00_LORA-CC68-915MHZ-TCXO]  100.53 17 270 top
NRF96W#63  -  [WIRELM-SMD_16P-L16.0-W16.0-P2.00_LORA-CC68-915MHZ-TCXO]  100.53 145.27 270 top
NRF96W#64  -  [WIRELM-SMD_16P-L16.0-W16.0-P2.00_LORA-CC68-915MHZ-TCXO]  100.53 58.02 270 top
NRF96W#65  -  [WIRELM-SMD_16P-L16.0-W16.0-P2.00_LORA-CC68-915MHZ-TCXO]  100.93 185.26 270 top
NRF96W#66  -  [WIRELM-SMD_16P-L16.0-W16.0-P2.00_LORA-CC68-915MHZ-TCXO]  148.79 102.6 270 top
NRF96W#67  -  [WIRELM-SMD_16P-L16.0-W16.0-P2.00_LORA-CC68-915MHZ-TCXO]  149.43 16.5 270 top
NRF96W#68  -  [WIRELM-SMD_16P-L16.0-W16.0-P2.00_LORA-CC68-915MHZ-TCXO]  149.43 144.76 270 top
NRF96W#69  -  [WIRELM-SMD_16P-L16.0-W16.0-P2.00_LORA-CC68-915MHZ-TCXO]  149.43 57.52 270 top
NRF96W#70  -  [WIRELM-SMD_16P-L16.0-W16.0-P2.00_LORA-CC68-915MHZ-TCXO]  149.83 184.75 270 top
NRF96W#71  -  [WIRELM-SMD_16P-L16.0-W16.0-P2.00_LORA-CC68-915MHZ-TCXO]  196.16 103.11 270 top
NRF96W#72  -  [WIRELM-SMD_16P-L16.0-W16.0-P2.00_LORA-CC68-915MHZ-TCXO]  196.8 58.02 270 top
NRF96W#73  -  [WIRELM-SMD_16P-L16.0-W16.0-P2.00_LORA-CC68-915MHZ-TCXO]  196.8 17 270 top
NRF96W#74  -  [WIRELM-SMD_16P-L16.0-W16.0-P2.00_LORA-CC68-915MHZ-TCXO]  196.8 145.27 270 top
NRF96W#75  -  [WIRELM-SMD_16P-L16.0-W16.0-P2.00_LORA-CC68-915MHZ-TCXO]  197.2 185.26 270 top

## Footprints (pads in the part's own frame, mm; a bottom-side part is the same pattern mirrored in y, then rotated)
CAP-TH_BD5.0-P2.00-D0.5-FD
  round 1.1 hole 0.7: 1(-1,0) 2(1,0)
HDR-TH_4P-HX-PH254-01-04-Z-L11.5
  rect 1.62x1.62 hole 1.02: 1(-3.81,0)
  round 1.62 hole 1.02: 2(-1.27,0) 3(1.27,0) 4(3.81,0)
SMD_BD4.0-L4.0-W4.0-D1.0
  custom 1.9x1.9 smd: 1(-1.052,0.921) 1(-0.921,-1.052) 1(0.921,1.052) 1(1.052,-0.921)
WIRELM-SMD_16P-L16.0-W16.0-P2.00_LORA-CC68-915MHZ-TCXO
  rect 2x1.2 smd: 1(-8,7) 2(-8,5) 3(-8,3) 4(-8,1) 5(-8,-1) 6(-8,-3) 7(-8,-5) 8(-8,-7) 9(8,-7) 10(8,-5) 11(8,-3) 12(8,-1) 13(8,1) 14(8,3) 15(8,5) 16(8,7)

## Nets
3.3V: H2.4 H2#2.4 H2#3.4 H2#4.4 H2#5.4 H2#6.4 H2#7.4 H2#8.4 H2#9.4 H2#10.4 H2#11.4 H2#12.4 H2#13.4 H2#14.4 H2#15.4 H2#16.4 H2#17.4 H2#18.4 H2#19.4 H2#20.4 H2#21.4 H2#22.4 H2#23.4 H2#24.4 H2#25.4 H2#26.4 H2#27.4 H2#28.4 H2#29.4 H2#30.4 H2#31.4 H2#32.4 H2#33.4 H2#34.4 H2#35.4 H2#36.4 H2#37.4 H2#38.4 H2#39.4 H2#40.4 H2#41.4 H2#42.4 H2#43.4 H2#44.4 H2#45.4 H2#46.4 H2#47.4 H2#48.4 H2#49.4 H2#50.4 H2#51.4 H2#52.4 H2#53.4 H2#54.4 H2#55.4 H2#56.4 H2#57.4 H2#58.4 H2#59.4 H2#60.4 H2#61.4 H2#62.4 H2#63.4 H2#64.4 H2#65.4 H2#66.4 H2#67.4 H2#68.4 H2#69.4 H2#70.4 H2#71.4 H2#72.4 H2#73.4 H2#74.4 H2#75.4 NRF96W.13 NRF96W#2.13 NRF96W#3.13 NRF96W#4.13 NRF96W#5.13 NRF96W#6.13 NRF96W#7.13 NRF96W#8.13 NRF96W#9.13 NRF96W#10.13 NRF96W#11.13 NRF96W#12.13 NRF96W#13.13 NRF96W#14.13 NRF96W#15.13 NRF96W#16.13 NRF96W#17.13 NRF96W#18.13 NRF96W#19.13 NRF96W#20.13 NRF96W#21.13 NRF96W#22.13 NRF96W#23.13 NRF96W#24.13 NRF96W#25.13 NRF96W#26.13 NRF96W#27.13 NRF96W#28.13 NRF96W#29.13 NRF96W#30.13 NRF96W#31.13 NRF96W#32.13 NRF96W#33.13 NRF96W#34.13 NRF96W#35.13 NRF96W#36.13 NRF96W#37.13 NRF96W#38.13 NRF96W#39.13 NRF96W#40.13 NRF96W#41.13 NRF96W#42.13 NRF96W#43.13 NRF96W#44.13 NRF96W#45.13 NRF96W#46.13 NRF96W#47.13 NRF96W#48.13 NRF96W#49.13 NRF96W#50.13 NRF96W#51.13 NRF96W#52.13 NRF96W#53.13 NRF96W#54.13 NRF96W#55.13 NRF96W#56.13 NRF96W#57.13 NRF96W#58.13 NRF96W#59.13 NRF96W#60.13 NRF96W#61.13 NRF96W#62.13 NRF96W#63.13 NRF96W#64.13 NRF96W#65.13 NRF96W#66.13 NRF96W#67.13 NRF96W#68.13 NRF96W#69.13 NRF96W#70.13 NRF96W#71.13 NRF96W#72.13 NRF96W#73.13 NRF96W#74.13 NRF96W#75.13
GND: H1.1 H1#2.1 H1#3.1 H1#4.1 H1#5.1 H1#6.1 H1#7.1 H1#8.1 H1#9.1 H1#10.1 H1#11.1 H1#12.1 H1#13.1 H1#14.1 H1#15.1 H1#16.1 H1#17.1 H1#18.1 H1#19.1 H1#20.1 H1#21.1 H1#22.1 H1#23.1 H1#24.1 H1#25.1 H1#26.1 H1#27.1 H1#28.1 H1#29.1 H1#30.1 H1#31.1 H1#32.1 H1#33.1 H1#34.1 H1#35.1 H1#36.1 H1#37.1 H1#38.1 H1#39.1 H1#40.1 H1#41.1 H1#42.1 H1#43.1 H1#44.1 H1#45.1 H1#46.1 H1#47.1 H1#48.1 H1#49.1 H1#50.1 H1#51.1 H1#52.1 H1#53.1 H1#54.1 H1#55.1 H1#56.1 H1#57.1 H1#58.1 H1#59.1 H1#60.1 H1#61.1 H1#62.1 H1#63.1 H1#64.1 H1#65.1 H1#66.1 H1#67.1 H1#68.1 H1#69.1 H1#70.1 H1#71.1 H1#72.1 H1#73.1 H1#74.1 H1#75.1 NRF96W.10 NRF96W#2.10 NRF96W#3.10 NRF96W#4.10 NRF96W#5.10 NRF96W#6.10 NRF96W#7.10 NRF96W#8.10 NRF96W#9.10 NRF96W#10.10 NRF96W#11.10 NRF96W#12.10 NRF96W#13.10 NRF96W#14.10 NRF96W#15.10 NRF96W#16.10 NRF96W#17.10 NRF96W#18.10 NRF96W#19.10 NRF96W#20.10 NRF96W#21.10 NRF96W#22.10 NRF96W#23.10 NRF96W#24.10 NRF96W#25.10 NRF96W#26.10 NRF96W#27.10 NRF96W#28.10 NRF96W#29.10 NRF96W#30.10 NRF96W#31.10 NRF96W#32.10 NRF96W#33.10 NRF96W#34.10 NRF96W#35.10 NRF96W#36.10 NRF96W#37.10 NRF96W#38.10 NRF96W#39.10 NRF96W#40.10 NRF96W#41.10 NRF96W#42.10 NRF96W#43.10 NRF96W#44.10 NRF96W#45.10 NRF96W#46.10 NRF96W#47.10 NRF96W#48.10 NRF96W#49.10 NRF96W#50.10 NRF96W#51.10 NRF96W#52.10 NRF96W#53.10 NRF96W#54.10 NRF96W#55.10 NRF96W#56.10 NRF96W#57.10 NRF96W#58.10 NRF96W#59.10 NRF96W#60.10 NRF96W#61.10 NRF96W#62.10 NRF96W#63.10 NRF96W#64.10 NRF96W#65.10 NRF96W#66.10 NRF96W#67.10 NRF96W#68.10 NRF96W#69.10 NRF96W#70.10 NRF96W#71.10 NRF96W#72.10 NRF96W#73.10 NRF96W#74.10 NRF96W#75.10
DIO0: H2.1 H2#2.1 H2#3.1 H2#4.1 H2#5.1 H2#6.1 H2#7.1 H2#8.1 H2#9.1 H2#10.1 H2#11.1 H2#12.1 H2#13.1 H2#14.1 H2#15.1 H2#16.1 H2#17.1 H2#18.1 H2#19.1 H2#20.1 H2#21.1 H2#22.1 H2#23.1 H2#24.1 H2#25.1 H2#26.1 H2#27.1 H2#28.1 H2#29.1 H2#30.1 H2#31.1 H2#32.1 H2#33.1 H2#34.1 H2#35.1 H2#36.1 H2#37.1 H2#38.1 H2#39.1 H2#40.1 H2#41.1 H2#42.1 H2#43.1 H2#44.1 H2#45.1 H2#46.1 H2#47.1 H2#48.1 H2#49.1 H2#50.1 H2#51.1 H2#52.1 H2#53.1 H2#54.1 H2#55.1 H2#56.1 H2#57.1 H2#58.1 H2#59.1 H2#60.1 H2#61.1 H2#62.1 H2#63.1 H2#64.1 H2#65.1 H2#66.1 H2#67.1 H2#68.1 H2#69.1 H2#70.1 H2#71.1 H2#72.1 H2#73.1 H2#74.1 H2#75.1 NRF96W.14 NRF96W#2.14 NRF96W#3.14 NRF96W#4.14 NRF96W#5.14 NRF96W#6.14 NRF96W#7.14 NRF96W#8.14 NRF96W#9.14 NRF96W#10.14 NRF96W#11.14 NRF96W#12.14 NRF96W#13.14 NRF96W#14.14 NRF96W#15.14 NRF96W#16.14 NRF96W#17.14 NRF96W#18.14 NRF96W#19.14 NRF96W#20.14 NRF96W#21.14 NRF96W#22.14 NRF96W#23.14 NRF96W#24.14 NRF96W#25.14 NRF96W#26.14 NRF96W#27.14 NRF96W#28.14 NRF96W#29.14 NRF96W#30.14 NRF96W#31.14 NRF96W#32.14 NRF96W#33.14 NRF96W#34.14 NRF96W#35.14 NRF96W#36.14 NRF96W#37.14 NRF96W#38.14 NRF96W#39.14 NRF96W#40.14 NRF96W#41.14 NRF96W#42.14 NRF96W#43.14 NRF96W#44.14 NRF96W#45.14 NRF96W#46.14 NRF96W#47.14 NRF96W#48.14 NRF96W#49.14 NRF96W#50.14 NRF96W#51.14 NRF96W#52.14 NRF96W#53.14 NRF96W#54.14 NRF96W#55.14 NRF96W#56.14 NRF96W#57.14 NRF96W#58.14 NRF96W#59.14 NRF96W#60.14 NRF96W#61.14 NRF96W#62.14 NRF96W#63.14 NRF96W#64.14 NRF96W#65.14 NRF96W#66.14 NRF96W#67.14 NRF96W#68.14 NRF96W#69.14 NRF96W#70.14 NRF96W#71.14 NRF96W#72.14 NRF96W#73.14 NRF96W#74.14 NRF96W#75.14
MISO: H1.4 H1#2.4 H1#3.4 H1#4.4 H1#5.4 H1#6.4 H1#7.4 H1#8.4 H1#9.4 H1#10.4 H1#11.4 H1#12.4 H1#13.4 H1#14.4 H1#15.4 H1#16.4 H1#17.4 H1#18.4 H1#19.4 H1#20.4 H1#21.4 H1#22.4 H1#23.4 H1#24.4 H1#25.4 H1#26.4 H1#27.4 H1#28.4 H1#29.4 H1#30.4 H1#31.4 H1#32.4 H1#33.4 H1#34.4 H1#35.4 H1#36.4 H1#37.4 H1#38.4 H1#39.4 H1#40.4 H1#41.4 H1#42.4 H1#43.4 H1#44.4 H1#45.4 H1#46.4 H1#47.4 H1#48.4 H1#49.4 H1#50.4 H1#51.4 H1#52.4 H1#53.4 H1#54.4 H1#55.4 H1#56.4 H1#57.4 H1#58.4 H1#59.4 H1#60.4 H1#61.4 H1#62.4 H1#63.4 H1#64.4 H1#65.4 H1#66.4 H1#67.4 H1#68.4 H1#69.4 H1#70.4 H1#71.4 H1#72.4 H1#73.4 H1#74.4 H1#75.4 NRF96W.2 NRF96W#2.2 NRF96W#3.2 NRF96W#4.2 NRF96W#5.2 NRF96W#6.2 NRF96W#7.2 NRF96W#8.2 NRF96W#9.2 NRF96W#10.2 NRF96W#11.2 NRF96W#12.2 NRF96W#13.2 NRF96W#14.2 NRF96W#15.2 NRF96W#16.2 NRF96W#17.2 NRF96W#18.2 NRF96W#19.2 NRF96W#20.2 NRF96W#21.2 NRF96W#22.2 NRF96W#23.2 NRF96W#24.2 NRF96W#25.2 NRF96W#26.2 NRF96W#27.2 NRF96W#28.2 NRF96W#29.2 NRF96W#30.2 NRF96W#31.2 NRF96W#32.2 NRF96W#33.2 NRF96W#34.2 NRF96W#35.2 NRF96W#36.2 NRF96W#37.2 NRF96W#38.2 NRF96W#39.2 NRF96W#40.2 NRF96W#41.2 NRF96W#42.2 NRF96W#43.2 NRF96W#44.2 NRF96W#45.2 NRF96W#46.2 NRF96W#47.2 NRF96W#48.2 NRF96W#49.2 NRF96W#50.2 NRF96W#51.2 NRF96W#52.2 NRF96W#53.2 NRF96W#54.2 NRF96W#55.2 NRF96W#56.2 NRF96W#57.2 NRF96W#58.2 NRF96W#59.2 NRF96W#60.2 NRF96W#61.2 NRF96W#62.2 NRF96W#63.2 NRF96W#64.2 NRF96W#65.2 NRF96W#66.2 NRF96W#67.2 NRF96W#68.2 NRF96W#69.2 NRF96W#70.2 NRF96W#71.2 NRF96W#72.2 NRF96W#73.2 NRF96W#74.2 NRF96W#75.2
MOSI: H2.2 H2#2.2 H2#3.2 H2#4.2 H2#5.2 H2#6.2 H2#7.2 H2#8.2 H2#9.2 H2#10.2 H2#11.2 H2#12.2 H2#13.2 H2#14.2 H2#15.2 H2#16.2 H2#17.2 H2#18.2 H2#19.2 H2#20.2 H2#21.2 H2#22.2 H2#23.2 H2#24.2 H2#25.2 H2#26.2 H2#27.2 H2#28.2 H2#29.2 H2#30.2 H2#31.2 H2#32.2 H2#33.2 H2#34.2 H2#35.2 H2#36.2 H2#37.2 H2#38.2 H2#39.2 H2#40.2 H2#41.2 H2#42.2 H2#43.2 H2#44.2 H2#45.2 H2#46.2 H2#47.2 H2#48.2 H2#49.2 H2#50.2 H2#51.2 H2#52.2 H2#53.2 H2#54.2 H2#55.2 H2#56.2 H2#57.2 H2#58.2 H2#59.2 H2#60.2 H2#61.2 H2#62.2 H2#63.2 H2#64.2 H2#65.2 H2#66.2 H2#67.2 H2#68.2 H2#69.2 H2#70.2 H2#71.2 H2#72.2 H2#73.2 H2#74.2 H2#75.2 NRF96W.3 NRF96W#2.3 NRF96W#3.3 NRF96W#4.3 NRF96W#5.3 NRF96W#6.3 NRF96W#7.3 NRF96W#8.3 NRF96W#9.3 NRF96W#10.3 NRF96W#11.3 NRF96W#12.3 NRF96W#13.3 NRF96W#14.3 NRF96W#15.3 NRF96W#16.3 NRF96W#17.3 NRF96W#18.3 NRF96W#19.3 NRF96W#20.3 NRF96W#21.3 NRF96W#22.3 NRF96W#23.3 NRF96W#24.3 NRF96W#25.3 NRF96W#26.3 NRF96W#27.3 NRF96W#28.3 NRF96W#29.3 NRF96W#30.3 NRF96W#31.3 NRF96W#32.3 NRF96W#33.3 NRF96W#34.3 NRF96W#35.3 NRF96W#36.3 NRF96W#37.3 NRF96W#38.3 NRF96W#39.3 NRF96W#40.3 NRF96W#41.3 NRF96W#42.3 NRF96W#43.3 NRF96W#44.3 NRF96W#45.3 NRF96W#46.3 NRF96W#47.3 NRF96W#48.3 NRF96W#49.3 NRF96W#50.3 NRF96W#51.3 NRF96W#52.3 NRF96W#53.3 NRF96W#54.3 NRF96W#55.3 NRF96W#56.3 NRF96W#57.3 NRF96W#58.3 NRF96W#59.3 NRF96W#60.3 NRF96W#61.3 NRF96W#62.3 NRF96W#63.3 NRF96W#64.3 NRF96W#65.3 NRF96W#66.3 NRF96W#67.3 NRF96W#68.3 NRF96W#69.3 NRF96W#70.3 NRF96W#71.3 NRF96W#72.3 NRF96W#73.3 NRF96W#74.3 NRF96W#75.3
NSS: H2.3 H2#2.3 H2#3.3 H2#4.3 H2#5.3 H2#6.3 H2#7.3 H2#8.3 H2#9.3 H2#10.3 H2#11.3 H2#12.3 H2#13.3 H2#14.3 H2#15.3 H2#16.3 H2#17.3 H2#18.3 H2#19.3 H2#20.3 H2#21.3 H2#22.3 H2#23.3 H2#24.3 H2#25.3 H2#26.3 H2#27.3 H2#28.3 H2#29.3 H2#30.3 H2#31.3 H2#32.3 H2#33.3 H2#34.3 H2#35.3 H2#36.3 H2#37.3 H2#38.3 H2#39.3 H2#40.3 H2#41.3 H2#42.3 H2#43.3 H2#44.3 H2#45.3 H2#46.3 H2#47.3 H2#48.3 H2#49.3 H2#50.3 H2#51.3 H2#52.3 H2#53.3 H2#54.3 H2#55.3 H2#56.3 H2#57.3 H2#58.3 H2#59.3 H2#60.3 H2#61.3 H2#62.3 H2#63.3 H2#64.3 H2#65.3 H2#66.3 H2#67.3 H2#68.3 H2#69.3 H2#70.3 H2#71.3 H2#72.3 H2#73.3 H2#74.3 H2#75.3 NRF96W.5 NRF96W#2.5 NRF96W#3.5 NRF96W#4.5 NRF96W#5.5 NRF96W#6.5 NRF96W#7.5 NRF96W#8.5 NRF96W#9.5 NRF96W#10.5 NRF96W#11.5 NRF96W#12.5 NRF96W#13.5 NRF96W#14.5 NRF96W#15.5 NRF96W#16.5 NRF96W#17.5 NRF96W#18.5 NRF96W#19.5 NRF96W#20.5 NRF96W#21.5 NRF96W#22.5 NRF96W#23.5 NRF96W#24.5 NRF96W#25.5 NRF96W#26.5 NRF96W#27.5 NRF96W#28.5 NRF96W#29.5 NRF96W#30.5 NRF96W#31.5 NRF96W#32.5 NRF96W#33.5 NRF96W#34.5 NRF96W#35.5 NRF96W#36.5 NRF96W#37.5 NRF96W#38.5 NRF96W#39.5 NRF96W#40.5 NRF96W#41.5 NRF96W#42.5 NRF96W#43.5 NRF96W#44.5 NRF96W#45.5 NRF96W#46.5 NRF96W#47.5 NRF96W#48.5 NRF96W#49.5 NRF96W#50.5 NRF96W#51.5 NRF96W#52.5 NRF96W#53.5 NRF96W#54.5 NRF96W#55.5 NRF96W#56.5 NRF96W#57.5 NRF96W#58.5 NRF96W#59.5 NRF96W#60.5 NRF96W#61.5 NRF96W#62.5 NRF96W#63.5 NRF96W#64.5 NRF96W#65.5 NRF96W#66.5 NRF96W#67.5 NRF96W#68.5 NRF96W#69.5 NRF96W#70.5 NRF96W#71.5 NRF96W#72.5 NRF96W#73.5 NRF96W#74.5 NRF96W#75.5
SCK: H1.3 H1#2.3 H1#3.3 H1#4.3 H1#5.3 H1#6.3 H1#7.3 H1#8.3 H1#9.3 H1#10.3 H1#11.3 H1#12.3 H1#13.3 H1#14.3 H1#15.3 H1#16.3 H1#17.3 H1#18.3 H1#19.3 H1#20.3 H1#21.3 H1#22.3 H1#23.3 H1#24.3 H1#25.3 H1#26.3 H1#27.3 H1#28.3 H1#29.3 H1#30.3 H1#31.3 H1#32.3 H1#33.3 H1#34.3 H1#35.3 H1#36.3 H1#37.3 H1#38.3 H1#39.3 H1#40.3 H1#41.3 H1#42.3 H1#43.3 H1#44.3 H1#45.3 H1#46.3 H1#47.3 H1#48.3 H1#49.3 H1#50.3 H1#51.3 H1#52.3 H1#53.3 H1#54.3 H1#55.3 H1#56.3 H1#57.3 H1#58.3 H1#59.3 H1#60.3 H1#61.3 H1#62.3 H1#63.3 H1#64.3 H1#65.3 H1#66.3 H1#67.3 H1#68.3 H1#69.3 H1#70.3 H1#71.3 H1#72.3 H1#73.3 H1#74.3 H1#75.3 NRF96W.4 NRF96W#2.4 NRF96W#3.4 NRF96W#4.4 NRF96W#5.4 NRF96W#6.4 NRF96W#7.4 NRF96W#8.4 NRF96W#9.4 NRF96W#10.4 NRF96W#11.4 NRF96W#12.4 NRF96W#13.4 NRF96W#14.4 NRF96W#15.4 NRF96W#16.4 NRF96W#17.4 NRF96W#18.4 NRF96W#19.4 NRF96W#20.4 NRF96W#21.4 NRF96W#22.4 NRF96W#23.4 NRF96W#24.4 NRF96W#25.4 NRF96W#26.4 NRF96W#27.4 NRF96W#28.4 NRF96W#29.4 NRF96W#30.4 NRF96W#31.4 NRF96W#32.4 NRF96W#33.4 NRF96W#34.4 NRF96W#35.4 NRF96W#36.4 NRF96W#37.4 NRF96W#38.4 NRF96W#39.4 NRF96W#40.4 NRF96W#41.4 NRF96W#42.4 NRF96W#43.4 NRF96W#44.4 NRF96W#45.4 NRF96W#46.4 NRF96W#47.4 NRF96W#48.4 NRF96W#49.4 NRF96W#50.4 NRF96W#51.4 NRF96W#52.4 NRF96W#53.4 NRF96W#54.4 NRF96W#55.4 NRF96W#56.4 NRF96W#57.4 NRF96W#58.4 NRF96W#59.4 NRF96W#60.4 NRF96W#61.4 NRF96W#62.4 NRF96W#63.4 NRF96W#64.4 NRF96W#65.4 NRF96W#66.4 NRF96W#67.4 NRF96W#68.4 NRF96W#69.4 NRF96W#70.4 NRF96W#71.4 NRF96W#72.4 NRF96W#73.4 NRF96W#74.4 NRF96W#75.4
$1N1589: Ant.1 Ant#2.1 Ant#3.1 Ant#4.1 Ant#5.1 Ant#6.1 Ant#7.1 Ant#8.1 Ant#9.1 Ant#10.1 Ant#11.1 Ant#12.1 Ant#13.1 Ant#14.1 Ant#15.1 Ant#16.1 Ant#17.1 Ant#18.1 Ant#19.1 Ant#20.1 Ant#21.1 Ant#22.1 Ant#23.1 Ant#24.1 Ant#25.1 Ant#26.1 Ant#27.1 Ant#28.1 Ant#29.1 Ant#30.1 Ant#31.1 Ant#32.1 Ant#33.1 Ant#34.1 Ant#35.1 Ant#36.1 Ant#37.1 Ant#38.1 Ant#39.1 Ant#40.1 Ant#41.1 Ant#42.1 Ant#43.1 Ant#44.1 Ant#45.1 Ant#46.1 Ant#47.1 Ant#48.1 Ant#49.1 Ant#50.1 Ant#51.1 Ant#52.1 Ant#53.1 Ant#54.1 Ant#55.1 Ant#56.1 Ant#57.1 Ant#58.1 Ant#59.1 Ant#60.1 Ant#61.1 Ant#62.1 Ant#63.1 Ant#64.1 Ant#65.1 Ant#66.1 Ant#67.1 Ant#68.1 Ant#69.1 Ant#70.1 Ant#71.1 Ant#72.1 Ant#73.1 Ant#74.1 Ant#75.1 NRF96W.9 NRF96W#2.9 NRF96W#3.9 NRF96W#4.9 NRF96W#5.9 NRF96W#6.9 NRF96W#7.9 NRF96W#8.9 NRF96W#9.9 NRF96W#10.9 NRF96W#11.9 NRF96W#12.9 NRF96W#13.9 NRF96W#14.9 NRF96W#15.9 NRF96W#16.9 NRF96W#17.9 NRF96W#18.9 NRF96W#19.9 NRF96W#20.9 NRF96W#21.9 NRF96W#22.9 NRF96W#23.9 NRF96W#24.9 NRF96W#25.9 NRF96W#26.9 NRF96W#27.9 NRF96W#28.9 NRF96W#29.9 NRF96W#30.9 NRF96W#31.9 NRF96W#32.9 NRF96W#33.9 NRF96W#34.9 NRF96W#35.9 NRF96W#36.9 NRF96W#37.9 NRF96W#38.9 NRF96W#39.9 NRF96W#40.9 NRF96W#41.9 NRF96W#42.9 NRF96W#43.9 NRF96W#44.9 NRF96W#45.9 NRF96W#46.9 NRF96W#47.9 NRF96W#48.9 NRF96W#49.9 NRF96W#50.9 NRF96W#51.9 NRF96W#52.9 NRF96W#53.9 NRF96W#54.9 NRF96W#55.9 NRF96W#56.9 NRF96W#57.9 NRF96W#58.9 NRF96W#59.9 NRF96W#60.9 NRF96W#61.9 NRF96W#62.9 NRF96W#63.9 NRF96W#64.9 NRF96W#65.9 NRF96W#66.9 NRF96W#67.9 NRF96W#68.9 NRF96W#69.9 NRF96W#70.9 NRF96W#71.9 NRF96W#72.9 NRF96W#73.9 NRF96W#74.9 NRF96W#75.9

Pads without a net: + 1 2; +#2 1 2; +#3 1 2; +#4 1 2; +#5 1 2; +#6 1 2; +#7 1 2; +#8 1 2; +#9 1 2; +#10 1 2; +#11 1 2; +#12 1 2; +#13 1 2; +#14 1 2; +#15 1 2; +#16 1 2; +#17 1 2; +#18 1 2; +#19 1 2; +#20 1 2; +#21 1 2; +#22 1 2; +#23 1 2; +#24 1 2; +#25 1 2; +#26 1 2; +#27 1 2; +#28 1 2; +#29 1 2; +#30 1 2; +#31 1 2; +#32 1 2; +#33 1 2; +#34 1 2; +#35 1 2; +#36 1 2; +#37 1 2; +#38 1 2; +#39 1 2; +#40 1 2; +#41 1 2; +#42 1 2; +#43 1 2; +#44 1 2; +#45 1 2; +#46 1 2; +#47 1 2; +#48 1 2; +#49 1 2; +#50 1 2; +#51 1 2; +#52 1 2; +#53 1 2; +#54 1 2; +#55 1 2; +#56 1 2; +#57 1 2; +#58 1 2; +#59 1 2; +#60 1 2; +#61 1 2; +#62 1 2; +#63 1 2; +#64 1 2; +#65 1 2; +#66 1 2; +#67 1 2; +#68 1 2; +#69 1 2; +#70 1 2; +#71 1 2; +#72 1 2; +#73 1 2; +#74 1 2; +#75 1 2; H1 2; H1#2 2; H1#3 2; H1#4 2; H1#5 2; H1#6 2; H1#7 2; H1#8 2; H1#9 2; H1#10 2; H1#11 2; H1#12 2; H1#13 2; H1#14 2; H1#15 2; H1#16 2; H1#17 2; H1#18 2; H1#19 2; H1#20 2; H1#21 2; H1#22 2; H1#23 2; H1#24 2; H1#25 2; H1#26 2; H1#27 2; H1#28 2; H1#29 2; H1#30 2; H1#31 2; H1#32 2; H1#33 2; H1#34 2; H1#35 2; H1#36 2; H1#37 2; H1#38 2; H1#39 2; H1#40 2; H1#41 2; H1#42 2; H1#43 2; H1#44 2; H1#45 2; H1#46 2; H1#47 2; H1#48 2; H1#49 2; H1#50 2; H1#51 2; H1#52 2; H1#53 2; H1#54 2; H1#55 2; H1#56 2; H1#57 2; H1#58 2; H1#59 2; H1#60 2; H1#61 2; H1#62 2; H1#63 2; H1#64 2; H1#65 2; H1#66 2; H1#67 2; H1#68 2; H1#69 2; H1#70 2; H1#71 2; H1#72 2; H1#73 2; H1#74 2; H1#75 2; NRF96W 1 6 7 8 11 12 15 16; NRF96W#2 1 6 7 8 11 12 15 16; NRF96W#3 1 6 7 8 11 12 15 16; NRF96W#4 1 6 7 8 11 12 15 16; NRF96W#5 1 6 7 8 11 12 15 16; NRF96W#6 1 6 7 8 11 12 15 16; NRF96W#7 1 6 7 8 11 12 15 16; NRF96W#8 1 6 7 8 11 12 15 16; NRF96W#9 1 6 7 8 11 12 15 16; NRF96W#10 1 6 7 8 11 12 15 16; NRF96W#11 1 6 7 8 11 12 15 16; NRF96W#12 1 6 7 8 11 12 15 16; NRF96W#13 1 6 7 8 11 12 15 16; NRF96W#14 1 6 7 8 11 12 15 16; NRF96W#15 1 6 7 8 11 12 15 16; NRF96W#16 1 6 7 8 11 12 15 16; NRF96W#17 1 6 7 8 11 12 15 16; NRF96W#18 1 6 7 8 11 12 15 16; NRF96W#19 1 6 7 8 11 12 15 16; NRF96W#20 1 6 7 8 11 12 15 16; NRF96W#21 1 6 7 8 11 12 15 16; NRF96W#22 1 6 7 8 11 12 15 16; NRF96W#23 1 6 7 8 11 12 15 16; NRF96W#24 1 6 7 8 11 12 15 16; NRF96W#25 1 6 7 8 11 12 15 16; NRF96W#26 1 6 7 8 11 12 15 16; NRF96W#27 1 6 7 8 11 12 15 16; NRF96W#28 1 6 7 8 11 12 15 16; NRF96W#29 1 6 7 8 11 12 15 16; NRF96W#30 1 6 7 8 11 12 15 16; NRF96W#31 1 6 7 8 11 12 15 16; NRF96W#32 1 6 7 8 11 12 15 16; NRF96W#33 1 6 7 8 11 12 15 16; NRF96W#34 1 6 7 8 11 12 15 16; NRF96W#35 1 6 7 8 11 12 15 16; NRF96W#36 1 6 7 8 11 12 15 16; NRF96W#37 1 6 7 8 11 12 15 16; NRF96W#38 1 6 7 8 11 12 15 16; NRF96W#39 1 6 7 8 11 12 15 16; NRF96W#40 1 6 7 8 11 12 15 16; NRF96W#41 1 6 7 8 11 12 15 16; NRF96W#42 1 6 7 8 11 12 15 16; NRF96W#43 1 6 7 8 11 12 15 16; NRF96W#44 1 6 7 8 11 12 15 16; NRF96W#45 1 6 7 8 11 12 15 16; NRF96W#46 1 6 7 8 11 12 15 16; NRF96W#47 1 6 7 8 11 12 15 16; NRF96W#48 1 6 7 8 11 12 15 16; NRF96W#49 1 6 7 8 11 12 15 16; NRF96W#50 1 6 7 8 11 12 15 16; NRF96W#51 1 6 7 8 11 12 15 16; NRF96W#52 1 6 7 8 11 12 15 16; NRF96W#53 1 6 7 8 11 12 15 16; NRF96W#54 1 6 7 8 11 12 15 16; NRF96W#55 1 6 7 8 11 12 15 16; NRF96W#56 1 6 7 8 11 12 15 16; NRF96W#57 1 6 7 8 11 12 15 16; NRF96W#58 1 6 7 8 11 12 15 16; NRF96W#59 1 6 7 8 11 12 15 16; NRF96W#60 1 6 7 8 11 12 15 16; NRF96W#61 1 6 7 8 11 12 15 16; NRF96W#62 1 6 7 8 11 12 15 16; NRF96W#63 1 6 7 8 11 12 15 16; NRF96W#64 1 6 7 8 11 12 15 16; NRF96W#65 1 6 7 8 11 12 15 16; NRF96W#66 1 6 7 8 11 12 15 16; NRF96W#67 1 6 7 8 11 12 15 16; NRF96W#68 1 6 7 8 11 12 15 16; NRF96W#69 1 6 7 8 11 12 15 16; NRF96W#70 1 6 7 8 11 12 15 16; NRF96W#71 1 6 7 8 11 12 15 16; NRF96W#72 1 6 7 8 11 12 15 16; NRF96W#73 1 6 7 8 11 12 15 16; NRF96W#74 1 6 7 8 11 12 15 16; NRF96W#75 1 6 7 8 11 12 15 16

## Routing (per net, layer and track width the routed paths; a pad name or vN(x,y) marks a point on that pad's centre or on a via; arc(x,y) is an arc through that point)
SCK: length 1998.1
  Top Layer w0.254: 198.31,273.92 198.45,274.07 198.45,275.96 199.21,276.72 210.52,276.72 215.85,271.38 215.85,268.34 215.11,267.6 214.58,267.6 ; 101.41,319.01 101.55,319.15 101.55,321.04 102.31,321.8 113.61,321.8 118.95,316.47 118.95,313.42 118.21,312.68 117.68,312.68 ; 150.56,440.6 150.71,440.74 150.71,442.63 151.47,443.4 162.77,443.4 168.11,438.06 168.11,435.01 167.37,434.27 166.84,434.27 ; 12.89,24.5 13.03,24.64 13.03,26.53 13.79,27.29 25.1,27.29 30.43,21.96 30.43,18.91 29.69,18.17 29.16,18.17 ; 102.04,361.17 102.18,361.31 102.18,363.21 102.95,363.97 114.25,363.97 119.58,358.63 119.58,355.59 118.84,354.85 118.31,354.85 ; 214.07,59.82 214.6,59.82 215.34,60.56 215.34,63.61 210.01,68.95 198.7,68.95 197.94,68.18 197.94,66.29 197.8,66.15 ; 102.07,609.37 102.21,609.51 102.21,611.4 102.97,612.16 114.28,612.16 119.61,606.83 119.61,603.78 118.87,603.04 118.34,603.04 ; 101.53,66.15 101.68,66.29 101.68,68.18 102.44,68.95 113.74,68.95 119.08,63.61 119.08,60.56 118.34,59.82 117.81,59.82 ; 214.58,226.58 215.11,226.58 215.85,227.32 215.85,230.36 210.52,235.7 199.21,235.7 198.45,234.94 198.45,233.05 198.31,232.9 ; 73.36,434.66 73.89,434.66 74.63,435.4 74.63,438.44 69.3,443.78 58,443.78 57.24,443.02 57.24,441.13 57.09,440.98 ; 57.46,232.78 57.61,232.92 57.61,234.81 58.37,235.57 69.67,235.57 75.01,230.24 75.01,227.19 74.27,226.45 73.74,226.45 ; 73.1,312.55 73.63,312.55 74.37,313.29 74.37,316.34 69.04,321.68 57.73,321.68 56.97,320.91 56.97,319.02 56.83,318.88 ; 150.56,568.87 150.71,569.01 150.71,570.9 151.47,571.67 162.77,571.67 168.11,566.33 168.11,563.28 167.37,562.54 166.84,562.54 ; 166.7,18.3 167.23,18.3 167.97,19.04 167.97,22.08 162.64,27.42 151.33,27.42 150.57,26.66 150.57,24.76 150.43,24.62 ; 149.93,526.71 150.07,526.85 150.07,528.74 150.83,529.5 162.14,529.5 167.47,524.17 167.47,521.12 166.73,520.38 166.2,520.38 ; 166.7,146.56 167.23,146.56 167.97,147.31 167.97,150.35 162.64,155.69 151.33,155.69 150.57,154.93 150.57,153.04 150.43,152.89 ; 197.16,111.24 197.31,111.38 197.31,113.27 198.07,114.03 209.37,114.03 214.71,108.7 214.71,105.65 213.97,104.91 213.44,104.91 ; 56.32,111.11 56.46,111.25 56.46,113.14 57.23,113.9 68.53,113.9 73.86,108.57 73.86,105.52 73.12,104.78 72.59,104.78 ; 102.04,273.92 102.18,274.07 102.18,275.96 102.95,276.72 114.25,276.72 119.58,271.38 119.58,268.34 118.84,267.6 118.31,267.6 ; 57.09,482 57.24,482.15 57.24,484.04 58,484.8 69.3,484.8 74.63,479.46 74.63,476.42 73.89,475.68 73.36,475.68 ; 167.1,186.55 167.63,186.55 168.37,187.29 168.37,190.34 163.03,195.67 151.73,195.67 150.97,194.91 150.97,193.02 150.83,192.88 ; 13.02,440.47 13.17,440.62 13.17,442.51 13.93,443.27 25.23,443.27 30.57,437.94 30.57,434.89 29.82,434.15 29.29,434.15 ; 150.94,232.39 151.08,232.54 151.08,234.43 151.84,235.19 163.14,235.19 168.48,229.86 168.48,226.81 167.74,226.07 167.21,226.07 ; 102.44,401.16 102.58,401.3 102.58,403.19 103.34,403.95 114.65,403.95 119.98,398.62 119.98,395.57 119.24,394.83 118.71,394.83 ; 198.2,193.39 198.34,193.53 198.34,195.42 199.1,196.18 210.41,196.18 215.74,190.85 215.74,187.8 215,187.06 214.47,187.06 ; 197.94,441.11 198.08,441.25 198.08,443.14 198.84,443.9 210.14,443.9 215.48,438.57 215.48,435.52 214.74,434.78 214.21,434.78 ; 13.4,360.54 13.54,360.68 13.54,362.57 14.3,363.33 25.6,363.33 30.94,358 30.94,354.95 30.2,354.21 29.67,354.21 ; 197.3,527.22 197.44,527.36 197.44,529.25 198.21,530.01 209.51,530.01 214.84,524.68 214.84,521.63 214.1,520.89 213.57,520.89 ; 150.56,481.62 150.71,481.77 150.71,483.66 151.47,484.42 162.77,484.42 168.11,479.08 168.11,476.04 167.37,475.3 166.84,475.3 ; 214.58,354.85 215.11,354.85 215.85,355.59 215.85,358.63 210.52,363.97 199.21,363.97 198.45,363.21 198.45,361.31 198.31,361.17 ; 73.23,18.68 73.76,18.68 74.5,19.42 74.5,22.46 69.16,27.8 57.86,27.8 57.1,27.04 57.1,25.15 56.96,25 ; 29.16,59.19 29.69,59.19 30.43,59.93 30.43,62.98 25.1,68.31 13.79,68.31 13.03,67.55 13.03,65.66 12.89,65.52 ; 198.71,401.16 198.85,401.3 198.85,403.19 199.61,403.95 210.91,403.95 216.25,398.62 216.25,395.57 215.51,394.83 214.98,394.83 ; 167.23,602.53 167.76,602.53 168.5,603.27 168.5,606.32 163.17,611.65 151.87,611.65 151.11,610.89 151.11,609 150.96,608.86 ; 57.46,361.05 57.61,361.19 57.61,363.08 58.37,363.84 69.67,363.84 75.01,358.51 75.01,355.46 74.27,354.72 73.74,354.72 ; 101.67,569.38 101.81,569.52 101.81,571.41 102.57,572.17 113.88,572.17 119.21,566.84 119.21,563.79 118.47,563.05 117.94,563.05 ; 149.79,110.73 149.94,110.87 149.94,112.76 150.7,113.52 162,113.52 167.34,108.19 167.34,105.14 166.59,104.4 166.06,104.4 ; 101.67,441.11 101.81,441.25 101.81,443.14 102.57,443.9 113.88,443.9 119.21,438.57 119.21,435.52 118.47,434.78 117.94,434.78 ; 29.67,225.94 30.2,225.94 30.94,226.68 30.94,229.73 25.6,235.06 14.3,235.06 13.54,234.3 13.54,232.41 13.4,232.27 ; 73.23,146.95 73.76,146.95 74.5,147.69 74.5,150.73 69.16,156.07 57.86,156.07 57.1,155.31 57.1,153.42 56.96,153.27 ; 117.81,147.07 118.34,147.07 119.08,147.81 119.08,150.86 113.74,156.19 102.44,156.19 101.68,155.43 101.68,153.54 101.53,153.4 ; 117.81,18.8 118.34,18.8 119.08,19.54 119.08,22.59 113.74,27.93 102.44,27.93 101.68,27.16 101.68,25.27 101.53,25.13 ; 197.94,569.38 198.08,569.52 198.08,571.41 198.84,572.17 210.14,572.17 215.48,566.84 215.48,563.79 214.74,563.05 214.21,563.05 ; 57.09,569.25 57.24,569.4 57.24,571.29 58,572.05 69.3,572.05 74.63,566.71 74.63,563.67 73.89,562.93 73.36,562.93 ; 13.02,481.5 13.17,481.64 13.17,483.53 13.93,484.29 25.23,484.29 30.57,478.96 30.57,475.91 29.82,475.17 29.29,475.17 ; 57.46,273.8 57.61,273.94 57.61,275.83 58.37,276.59 69.67,276.59 75.01,271.26 75.01,268.21 74.27,267.47 73.74,267.47 ; 57.86,401.03 58.01,401.17 58.01,403.06 58.77,403.83 70.07,403.83 75.4,398.49 75.4,395.44 74.66,394.7 74.13,394.7 ; 151.33,400.65 151.48,400.79 151.48,402.68 152.24,403.45 163.54,403.45 168.88,398.11 168.88,395.06 168.14,394.32 167.61,394.32 ; 100.9,111.24 101.04,111.38 101.04,113.27 101.8,114.03 113.11,114.03 118.44,108.7 118.44,105.65 117.7,104.91 117.17,104.91 ; 117.31,520.89 117.84,520.89 118.58,521.63 118.58,524.68 113.24,530.01 101.94,530.01 101.18,529.25 101.18,527.36 101.03,527.22 ; 13.02,568.74 13.17,568.89 13.17,570.78 13.93,571.54 25.23,571.54 30.57,566.21 30.57,563.16 29.82,562.42 29.29,562.42 ; 29.16,146.44 29.69,146.44 30.43,147.18 30.43,150.23 25.1,155.56 13.79,155.56 13.03,154.8 13.03,152.91 12.89,152.76 ; 13.4,273.29 13.54,273.43 13.54,275.32 14.3,276.08 25.6,276.08 30.94,270.75 30.94,267.7 30.2,266.96 29.67,266.96 ; 118.31,226.58 118.84,226.58 119.58,227.32 119.58,230.36 114.25,235.7 102.95,235.7 102.18,234.94 102.18,233.05 102.04,232.9 ; 56.96,66.02 57.1,66.17 57.1,68.06 57.86,68.82 69.16,68.82 74.5,63.49 74.5,60.44 73.76,59.7 73.23,59.7 ; 166.57,312.17 167.1,312.17 167.84,312.91 167.84,315.96 162.51,321.3 151.21,321.3 150.44,320.53 150.44,318.64 150.3,318.5 ; 56.46,527.09 56.6,527.23 56.6,529.12 57.36,529.88 68.66,529.88 74,524.55 74,521.5 73.26,520.76 72.73,520.76 ; 197.8,153.4 197.94,153.54 197.94,155.43 198.7,156.19 210.01,156.19 215.34,150.86 215.34,147.81 214.6,147.07 214.07,147.07 ; 118.2,187.06 118.73,187.06 119.47,187.8 119.47,190.85 114.14,196.18 102.84,196.18 102.07,195.42 102.07,193.53 101.93,193.39 ; 13.29,192.75 13.43,192.89 13.43,194.79 14.19,195.55 25.49,195.55 30.83,190.21 30.83,187.17 30.09,186.42 29.56,186.42 ; 117.94,475.8 118.47,475.8 119.21,476.54 119.21,479.59 113.88,484.93 102.57,484.93 101.81,484.16 101.81,482.27 101.67,482.13 ; 150.94,360.66 151.08,360.81 151.08,362.7 151.84,363.46 163.14,363.46 168.48,358.12 168.48,355.08 167.74,354.34 167.21,354.34 ; 150.94,273.42 151.08,273.56 151.08,275.45 151.84,276.21 163.14,276.21 168.48,270.88 168.48,267.83 167.74,267.09 167.21,267.09 ; 214.61,603.04 215.14,603.04 215.88,603.78 215.88,606.83 210.54,612.16 199.24,612.16 198.48,611.4 198.48,609.51 198.33,609.37 ; 28.52,104.27 29.05,104.27 29.79,105.01 29.79,108.06 24.46,113.4 13.16,113.4 12.4,112.63 12.4,110.74 12.25,110.6 ; 197.8,25.13 197.94,25.27 197.94,27.16 198.7,27.93 210.01,27.93 215.34,22.59 215.34,19.54 214.6,18.8 214.07,18.8 ; 13.42,608.73 13.56,608.87 13.56,610.76 14.33,611.53 25.63,611.53 30.96,606.19 30.96,603.14 30.22,602.4 29.69,602.4 ; 57.35,193.26 57.5,193.4 57.5,195.29 58.26,196.06 69.56,196.06 74.9,190.72 74.9,187.67 74.16,186.93 73.63,186.93 ; 12.76,318.37 12.9,318.52 12.9,320.41 13.66,321.17 24.97,321.17 30.3,315.83 30.3,312.79 29.56,312.05 29.03,312.05 ; 150.43,65.64 150.57,65.79 150.57,67.68 151.33,68.44 162.64,68.44 167.97,63.1 167.97,60.06 167.23,59.32 166.7,59.32 ; 213.94,312.68 214.47,312.68 215.21,313.42 215.21,316.47 209.88,321.8 198.58,321.8 197.81,321.04 197.81,319.15 197.67,319.01 ; 57.49,609.24 57.63,609.38 57.63,611.27 58.4,612.03 69.7,612.03 75.03,606.7 75.03,603.65 74.29,602.91 73.76,602.91 ; 214.21,475.8 214.74,475.8 215.48,476.54 215.48,479.59 210.14,484.93 198.84,484.93 198.08,484.16 198.08,482.27 197.94,482.13 ; 30.07,394.2 30.6,394.2 31.34,394.94 31.34,397.99 26,403.32 14.7,403.32 13.94,402.56 13.94,400.67 13.79,400.52 ; 12.39,526.58 12.53,526.72 12.53,528.61 13.29,529.38 24.6,529.38 29.93,524.04 29.93,520.99 29.19,520.25 28.66,520.25
DIO0: length 117.5
  Top Layer w0.254: 58.51,511.6 58.51,516.29 61.26,519.44 70.73,519.44 71.47,519.89 71.47,522.13 69.94,523.47 ; 59.14,553.76 59.14,558.46 61.9,561.6 71.36,561.6 72.1,562.05 72.1,564.3 70.57,565.64 ; 59.14,466.51 59.14,471.21 61.9,474.35 71.36,474.35 72.1,474.8 72.1,477.05 70.57,478.39 ; 59.14,425.49 59.14,430.19 61.9,433.33 71.36,433.33 72.1,433.78 72.1,436.03 70.57,437.37 ; 59.54,593.75 59.54,598.45 62.3,601.59 71.76,601.59 72.5,602.04 72.5,604.28 70.97,605.62
MOSI: length 76.9
  Top Layer w0.254: 58.51,527.26 58.51,524.3 61.81,520.99 69.55,520.99 ; 59.14,569.42 59.14,566.46 62.44,563.16 70.19,563.16 ; 59.14,482.17 59.14,479.21 62.44,475.91 70.19,475.91 ; 59.14,441.15 59.14,438.19 62.44,434.89 70.19,434.89 ; 59.54,609.41 59.54,606.45 62.84,603.14 70.59,603.14
NSS: length 195.1
  Top Layer w0.254: 54.46,527.09 54.46,529.59 56.47,530.84 69.74,530.84 75.02,525.57 75.02,518.05 73.86,516.93 71.73,516.93 70.19,518.45 ; 55.09,569.25 55.09,571.76 57.11,573 70.38,573 75.65,567.73 75.65,560.21 74.49,559.09 72.36,559.09 70.82,560.62 ; 55.09,482 55.09,484.51 57.11,485.75 70.38,485.75 75.65,480.48 75.65,472.96 74.49,471.84 72.36,471.84 70.82,473.37 ; 55.09,440.98 55.09,443.49 57.11,444.73 70.38,444.73 75.65,439.46 75.65,431.94 74.49,430.82 72.36,430.82 70.82,432.35 ; 55.49,609.24 55.49,611.74 57.51,612.99 70.78,612.99 76.05,607.72 76.05,600.2 74.89,599.08 72.76,599.08 71.22,600.6
